# EAGLE design main (EAGLE 5.05)

## Sheet 1 of 4
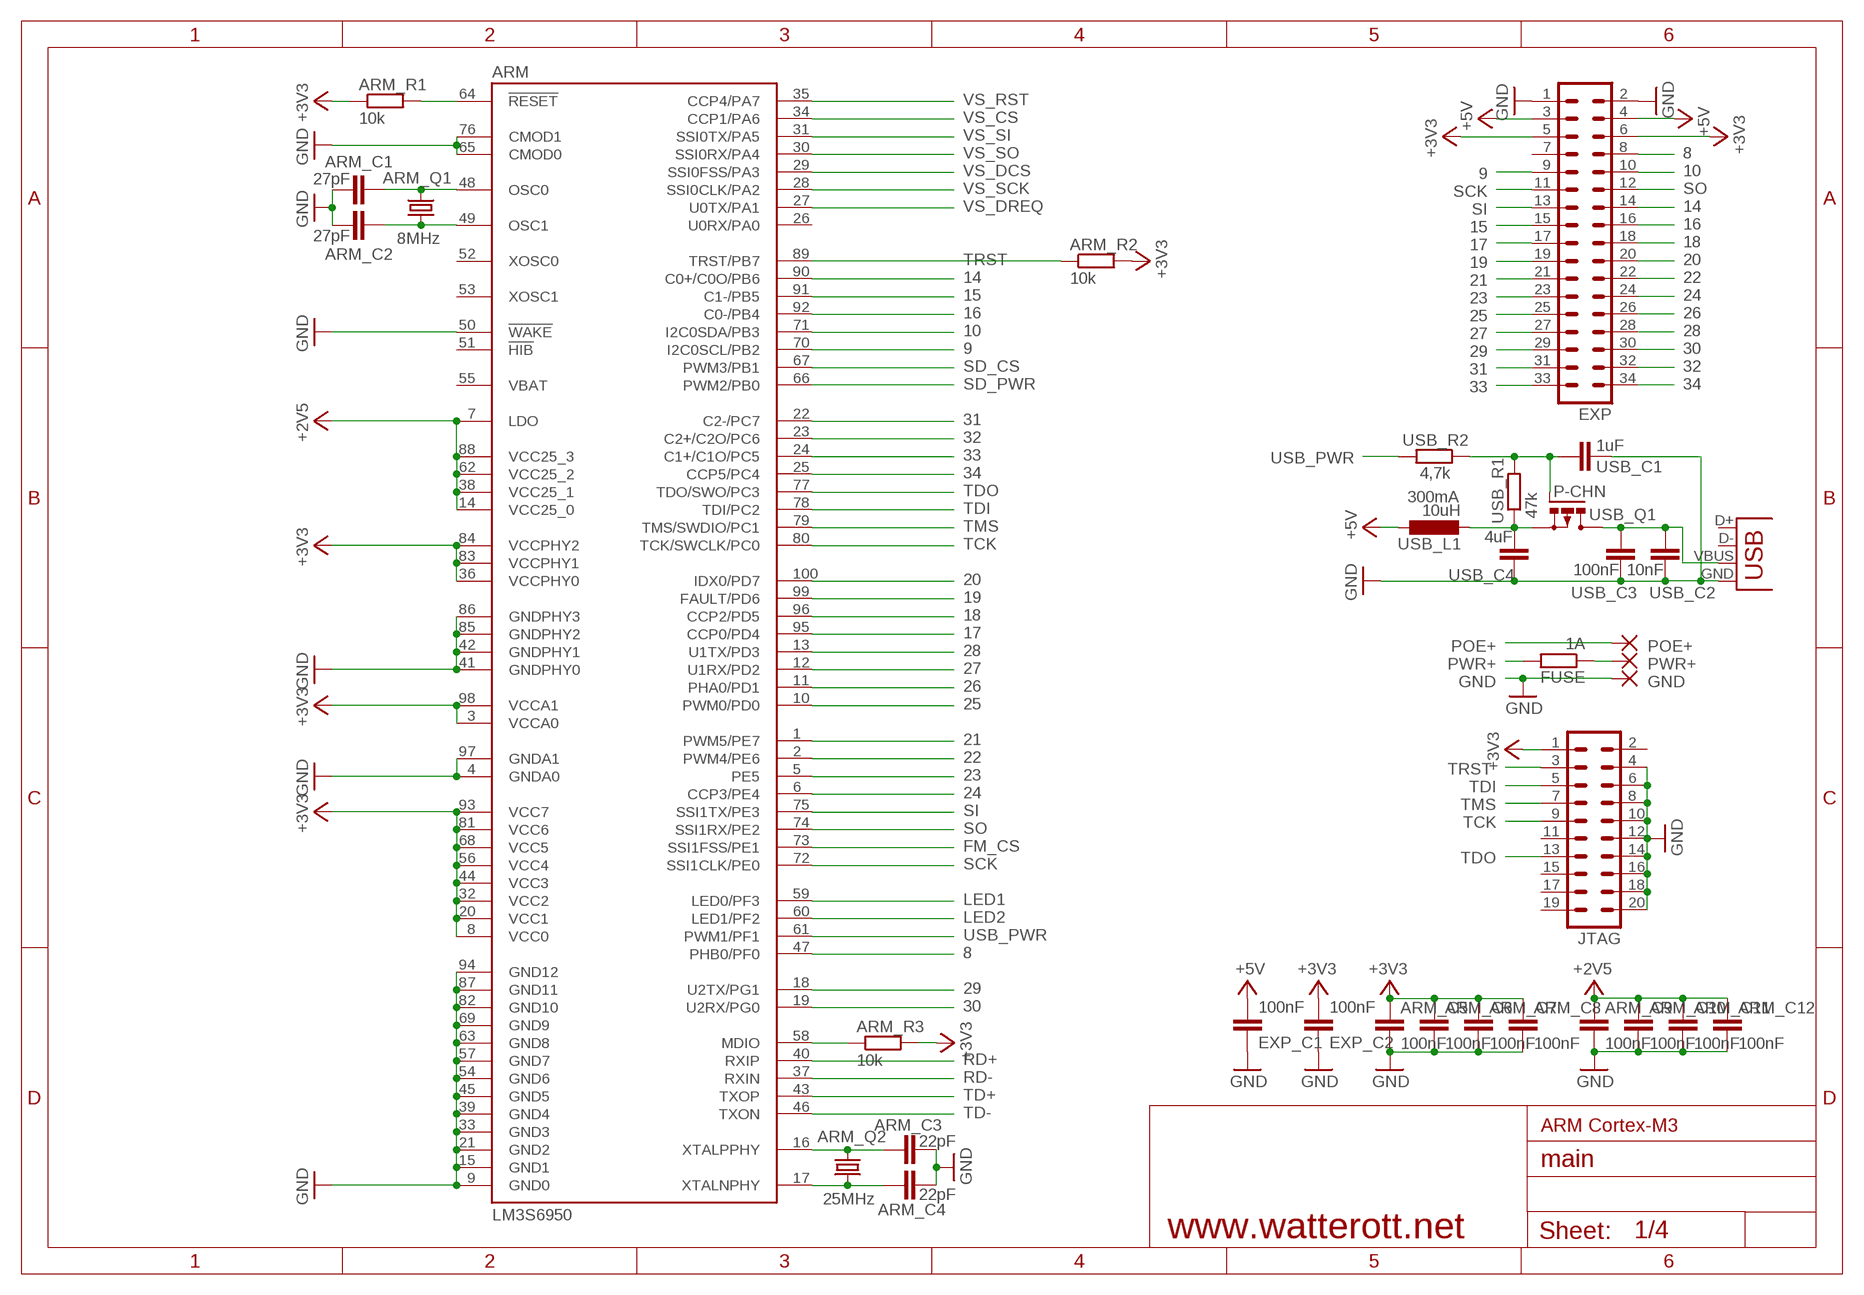
[diagram p0: schematic, sheet 1]

### Parts
ARM  LM3S6950  [LQFP100]
ARM_C1  27pF  C-EUC0603  [C0603]
ARM_C2  27pF  C-EUC0603  [C0603]
ARM_C3  22pF  C-EUC0603  [C0603]
ARM_C4  22pF  C-EUC0603  [C0603]
ARM_C5  100nF  C-EUC0603  [C0603]
ARM_C6  100nF  C-EUC0603  [C0603]
ARM_C7  100nF  C-EUC0603  [C0603]
ARM_C8  100nF  C-EUC0603  [C0603]
ARM_C9  100nF  C-EUC0603  [C0603]
ARM_C10  100nF  C-EUC0603  [C0603]
ARM_C11  100nF  C-EUC0603  [C0603]
ARM_C12  100nF  C-EUC0603  [C0603]
ARM_Q1  8MHz  HC49UP  [HC49UP]
ARM_Q2  25MHz  HC49UP  [HC49UP]
ARM_R1  10k  R-EU_R0603  [R0603]
ARM_R2  10k  R-EU_R0603  [R0603]
ARM_R3  10k  R-EU_R0603  [R0603]
EXP  MA17-2  [MA17-2]
EXP_C1  100nF  C-EUC0603  [C0603]
EXP_C2  100nF  C-EUC0603  [C0603]
FUSE  1A  R-EU_R1206  [R1206]
GND  SMD2  [SMD1,27-2,54]
JTAG  MA10-2  [MA10-2]
POE+  SMD2  [SMD1,27-2,54]
PWR+  SMD2  [SMD1,27-2,54]
USB  USB-A-S  [USB-A-S]
USB_C1  1uF  C-EUC0603  [C0603]
USB_C2  10nF  C-EUC0603  [C0603]
USB_C3  100nF  C-EUC0603  [C0603]
USB_C4  4uF  C-EUC1206  [C1206]
USB_L1  10uH  L-EUL4532C  [L4532M]
USB_Q1  P-CHN  IRLML6402  [MICRO3]
USB_R1  47k  R-EU_R0603  [R0603]
USB_R2  4,7k  R-EU_R0603  [R0603]

### Nets
8: ARM.47(PHB0/PF0) EXP.8
9: ARM.70(I2C0SCL/PB2) EXP.9
10: ARM.71(I2C0SDA/PB3) EXP.10
14: ARM.90(C0+/C0O/PB6) EXP.14
15: ARM.91(C1-/PB5) EXP.15
16: ARM.92(C0-/PB4) EXP.16
17: ARM.95(CCP0/PD4) EXP.17
18: ARM.96(CCP2/PD5) EXP.18
19: ARM.99(FAULT/PD6) EXP.19
20: ARM.100(IDX0/PD7) EXP.20
21: ARM.1(PWM5/PE7) EXP.21
22: ARM.2(PWM4/PE6) EXP.22
23: ARM.5(PE5) EXP.23
24: ARM.6(CCP3/PE4) EXP.24
25: ARM.10(PWM0/PD0) EXP.25
26: ARM.11(PHA0/PD1) EXP.26
27: ARM.12(U1RX/PD2) EXP.27
28: ARM.13(U1TX/PD3) EXP.28
29: ARM.18(U2TX/PG1) EXP.29
30: ARM.19(U2RX/PG0) EXP.30
31: ARM.22(C2-/PC7) EXP.31
32: ARM.23(C2+/C2O/PC6) EXP.32
33: ARM.24(C1+/C1O/PC5) EXP.33
34: ARM.25(CCP5/PC4) EXP.34
+3V3: ARM.3(VCCA0) ARM.8(VCC0) ARM.20(VCC1) ARM.32(VCC2) ARM.36(VCCPHY0) ARM.44(VCC3) ARM.56(VCC4) ARM.68(VCC5) ARM.81(VCC6) ARM.83(VCCPHY1) ARM.84(VCCPHY2) ARM.93(VCC7) ARM.98(VCCA1) ARM_C5.1 ARM_C6.1 ARM_C7.1 ARM_C8.1 ARM_R1.1 ARM_R2.2 ARM_R3.2 EXP.5 EXP.6 EXP_C2.2 JTAG.1 ; also sheet 2,3,4
+5V: EXP.3 EXP.4 EXP_C1.2 USB_L1.1 ; also sheet 4
FM_CS: ARM.73(SSI1FSS/PE1) ; also sheet 2
GND: ARM.4(GNDA0) ARM.9(GND0) ARM.15(GND1) ARM.21(GND2) ARM.33(GND3) ARM.39(GND4) ARM.41(GNDPHY0) ARM.42(GNDPHY1) ARM.45(GND5) ARM.50(!WAKE) ARM.54(GND6) ARM.57(GND7) ARM.63(GND8) ARM.65(CMOD0) ARM.69(GND9) ARM.76(CMOD1) ARM.82(GND10) ARM.85(GNDPHY2) ARM.86(GNDPHY3) ARM.87(GND11) ARM.94(GND12) ARM.97(GNDA1) ARM_C1.2 ARM_C2.2 ARM_C3.2 ARM_C4.2 ARM_C5.2 ARM_C6.2 ARM_C7.2 ARM_C8.2 ARM_C9.2 ARM_C10.2 ARM_C11.2 ARM_C12.2 EXP.1 EXP.2 EXP_C1.1 EXP_C2.1 GND.1(P) JTAG.4 JTAG.6 JTAG.8 JTAG.10 JTAG.12 JTAG.14 JTAG.16 JTAG.18 JTAG.20 USB.GND USB_C1.1 USB_C2.2 USB_C3.2 USB_C4.1 ; also sheet 2,3,4
LED1: ARM.59(LED0/PF3) ; also sheet 2
LED2: ARM.60(LED1/PF2) ; also sheet 2
MDIO: ARM.58(MDIO) ARM_R3.1
N$2: USB_C4.2 USB_L1.2 USB_Q1.2(S) USB_R1.1
N$9: ARM.48(OSC0) ARM_C1.1 ARM_Q1.2
N$10: ARM.49(OSC1) ARM_C2.1 ARM_Q1.1
N$12: USB.VBUS USB_C2.1 USB_C3.1 USB_Q1.3(D)
N$13: ARM.17(XTALNPHY) ARM_C4.1 ARM_Q2.2
N$14: ARM.16(XTALPPHY) ARM_C3.1 ARM_Q2.1
N$16: USB_C1.2 USB_Q1.1(G) USB_R1.2 USB_R2.1
POE+: POE+.1(P) ; also sheet 2
PWR+: FUSE.2 ; also sheet 2,4
RD+: ARM.40(RXIP) ; also sheet 2
RD-: ARM.37(RXIN) ; also sheet 2
RESET: ARM.64(!RESET) ARM_R1.2
SCK: ARM.72(SSI1CLK/PE0) EXP.11 ; also sheet 2
SD_CS: ARM.67(PWM3/PB1) ; also sheet 2
SD_PWR: ARM.66(PWM2/PB0) ; also sheet 2
SI: ARM.75(SSI1TX/PE3) EXP.13 ; also sheet 2
SO: ARM.74(SSI1RX/PE2) EXP.12 ; also sheet 2
TCK: ARM.80(TCK/SWCLK/PC0) JTAG.9
TD+: ARM.43(TXOP) ; also sheet 2
TD-: ARM.46(TXON) ; also sheet 2
TDI: ARM.78(TDI/PC2) JTAG.5
TDO: ARM.77(TDO/SWO/PC3) JTAG.13
TMS: ARM.79(TMS/SWDIO/PC1) JTAG.7
TRST: ARM.89(TRST/PB7) ARM_R2.1 JTAG.3
USB_PWR: ARM.61(PWM1/PF1) USB_R2.2
VCC: FUSE.1 PWR+.1(P)
VCCIO: ARM.7(LDO) ARM.14(VCC25_0) ARM.38(VCC25_1) ARM.62(VCC25_2) ARM.88(VCC25_3) ARM_C9.1 ARM_C10.1 ARM_C11.1 ARM_C12.1 ; supply symbol labelled +2V5
VS_CS: ARM.34(CCP1/PA6) ; also sheet 3
VS_DCS: ARM.29(SSI0FSS/PA3) ; also sheet 3
VS_DREQ: ARM.27(U0TX/PA1) ; also sheet 3
VS_RST: ARM.35(CCP4/PA7) ; also sheet 3
VS_SCK: ARM.28(SSI0CLK/PA2) ; also sheet 3
VS_SI: ARM.31(SSI0TX/PA5) ; also sheet 3
VS_SO: ARM.30(SSI0RX/PA4) ; also sheet 3
Unconnected: ARM.26(U0RX/PA0) ARM.51(!HIB) ARM.52(XOSC0) ARM.53(XOSC1) EXP.7 JTAG.2 JTAG.11 JTAG.15 JTAG.17 JTAG.19 USB.D+ USB.D-

### Notes on the sheet
- 300mA
- ARM Cortex-M3
- www.watterott.net

## Sheet 2 of 4
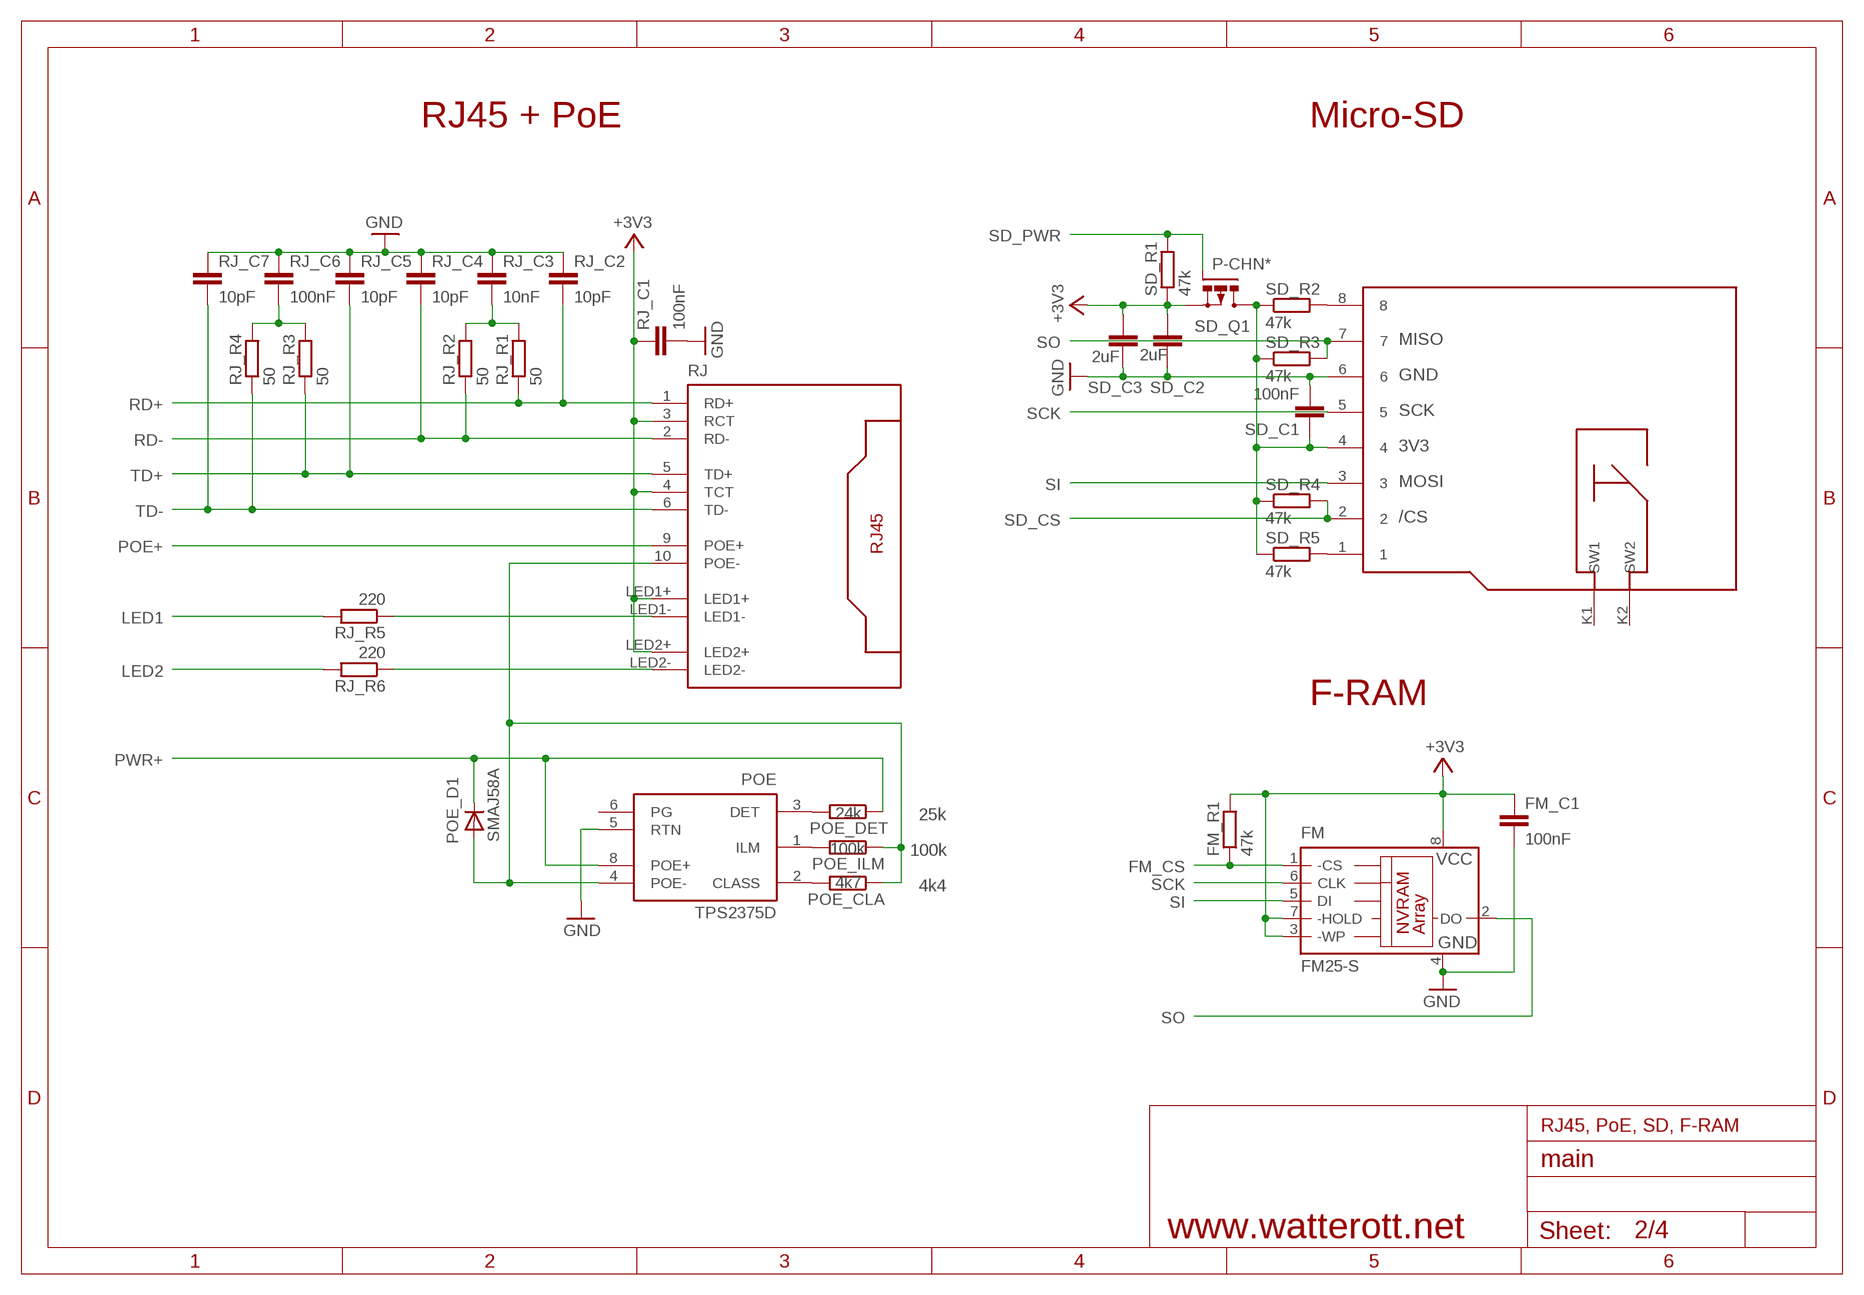
[diagram p1: schematic, sheet 2]

### Parts
FM  FM25-S  [SO8]
FM_C1  100nF  C-EUC0603  [C0603]
FM_R1  47k  R-EU_R0603  [R0603]
POE  TPS2375D  TPS237X  [SO08]
POE_CLA  4k7  R-EU_R0603  [R0603]
POE_D1  SMAJ58A  DIODE-DO214AA  [DO214AA]
POE_DET  24k  R-EU_R0603  [R0603]
POE_ILM  100k  R-EU_R0603  [R0603]
RJ  RJ45-8-POEWE  [WE_POE]
RJ_C1  100nF  C-EUC0603  [C0603]
RJ_C2  10pF  C-EUC0603  [C0603]
RJ_C3  10nF  C-EUC0603  [C0603]
RJ_C4  10pF  C-EUC0603  [C0603]
RJ_C5  10pF  C-EUC0603  [C0603]
RJ_C6  100nF  C-EUC0603  [C0603]
RJ_C7  10pF  C-EUC0603  [C0603]
RJ_R1  50  R-EU_R0603  [R0603]
RJ_R2  50  R-EU_R0603  [R0603]
RJ_R3  50  R-EU_R0603  [R0603]
RJ_R4  50  R-EU_R0603  [R0603]
RJ_R5  220  R-EU_R0603  [R0603]
RJ_R6  220  R-EU_R0603  [R0603]
SD  MICRO-SD  [MICRO-SD]
SD_C1  100nF  C-EUC0603  [C0603]
SD_C2  2uF  C-EUC0603  [C0603]
SD_C3  2uF  C-EUC0805  [C0805]
SD_Q1  P-CHN*  IRLML6402  [MICRO3]
SD_R1  47k  R-EU_R0603  [R0603]
SD_R2  47k  R-EU_R0603  [R0603]
SD_R3  47k  R-EU_R0603  [R0603]
SD_R4  47k  R-EU_R0603  [R0603]
SD_R5  47k  R-EU_R0603  [R0603]

### Nets
+3V3: FM.3(-WP) FM.7(-HOLD) FM.8(VCC) FM_C1.1 FM_R1.2 RJ.3(RCT) RJ.4(TCT) RJ.LED1+ RJ.LED2+ RJ_C1.1 SD_C2.2 SD_C3.2 SD_Q1.2(S) SD_R1.1 ; also sheet 1,3,4
CLASS: POE.2(CLASS) POE_CLA.2
DET: POE.3(DET) POE_DET.2
FM_CS: FM.1(-CS) FM_R1.1 ; also sheet 1
GND: FM.4(GND) FM_C1.2 POE.5(RTN) RJ_C1.2 RJ_C2.1 RJ_C3.1 RJ_C4.1 RJ_C5.1 RJ_C6.1 RJ_C7.1 SD.6 SD_C1.2 SD_C2.1 SD_C3.1 ; also sheet 1,3,4
ILM: POE.1(ILM) POE_ILM.2
LED1: RJ_R5.2 ; also sheet 1
LED2: RJ_R6.2 ; also sheet 1
N$3: SD.1 SD_R5.2
N$4: RJ.LED2- RJ_R6.1
N$5: RJ.LED1- RJ_R5.1
N$6: RJ_C6.2 RJ_R3.2 RJ_R4.2
N$7: RJ_C3.2 RJ_R1.2 RJ_R2.2
N$15: SD.8 SD_R2.2
POE+: RJ.9(POE+) ; also sheet 1
POE-: POE.4(POE-) POE_CLA.1 POE_D1.A POE_ILM.1 RJ.10(POE-)
PWR+: POE.8(POE+) POE_D1.C POE_DET.1 ; also sheet 1,4
RD+: RJ.1(RD+) RJ_C2.2 RJ_R1.1 ; also sheet 1
RD-: RJ.2(RD-) RJ_C4.2 RJ_R2.1 ; also sheet 1
SCK: FM.6(CLK) SD.5 ; also sheet 1
SD_3V3: SD.4 SD_C1.1 SD_Q1.3(D) SD_R2.1 SD_R3.1 SD_R4.1 SD_R5.1
SD_CS: SD.2 SD_R4.2 ; also sheet 1
SD_PWR: SD_Q1.1(G) SD_R1.2 ; also sheet 1
SI: FM.5(DI) SD.3 ; also sheet 1
SO: FM.2(DO) SD.7 SD_R3.2 ; also sheet 1
TD+: RJ.5(TD+) RJ_C5.2 RJ_R3.1 ; also sheet 1
TD-: RJ.6(TD-) RJ_C7.2 RJ_R4.1 ; also sheet 1
Unconnected: POE.6(PG) SD.K1(SW1) SD.K2(SW2)

### Notes on the sheet
- RJ45 + PoE | Micro-SD
- F-RAM
- 25k
- 100k
- 4k4
- RJ45, PoE, SD, F-RAM
- www.watterott.net

## Sheet 3 of 4
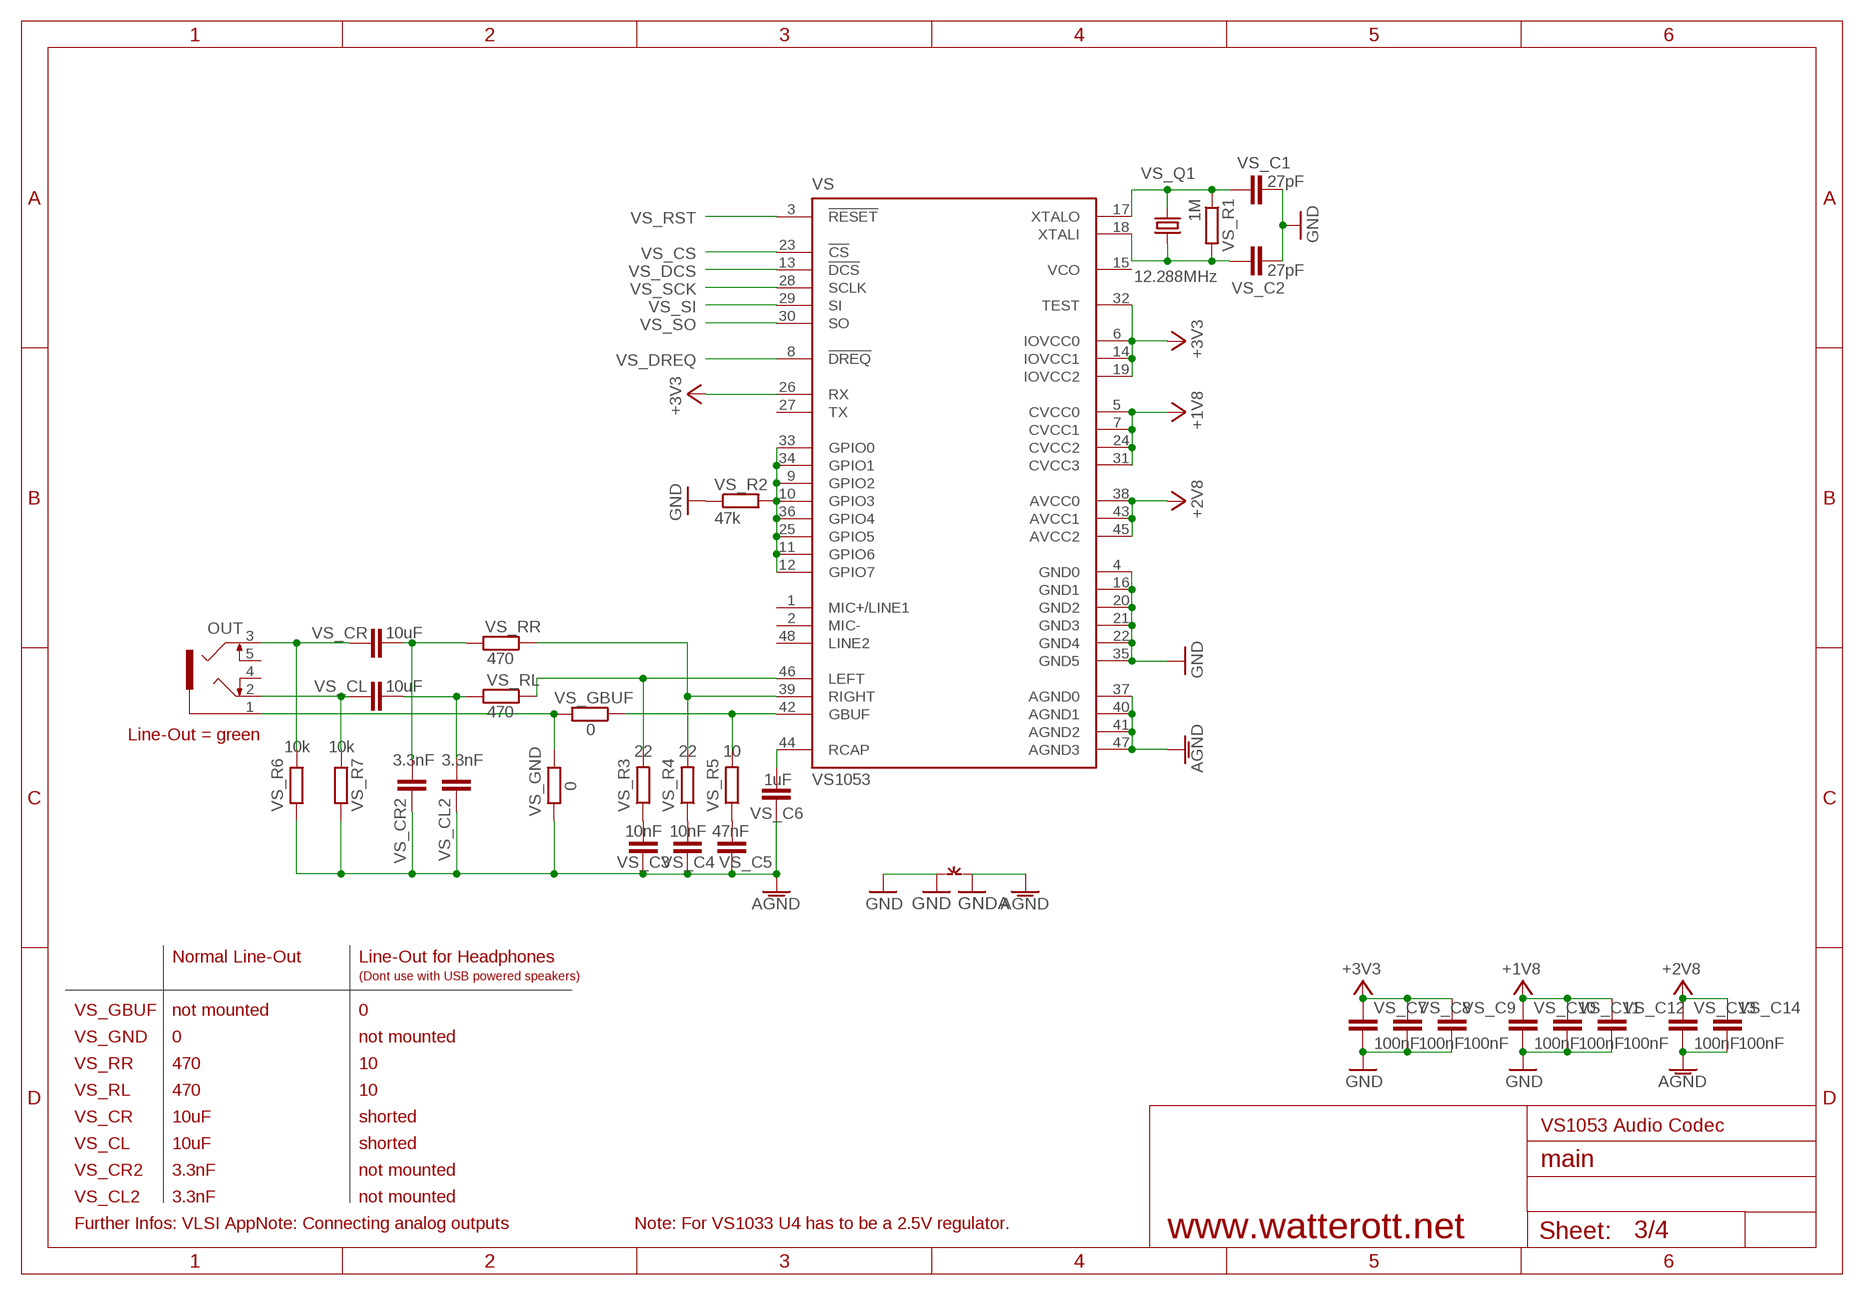
[diagram p2: schematic, sheet 3]

### Parts
OUT  1503_09  [1503_09]
VS  VS1053  [LQFP-48]
VS_C1  27pF  C-EUC0603  [C0603]
VS_C2  27pF  C-EUC0603  [C0603]
VS_C3  10nF  C-EUC0603  [C0603]
VS_C4  10nF  C-EUC0603  [C0603]
VS_C5  47nF  C-EUC0603  [C0603]
VS_C6  1uF  C-EUC0603  [C0603]
VS_C7  100nF  C-EUC0603  [C0603]
VS_C8  100nF  C-EUC0603  [C0603]
VS_C9  100nF  C-EUC0603  [C0603]
VS_C10  100nF  C-EUC0603  [C0603]
VS_C11  100nF  C-EUC0603  [C0603]
VS_C12  100nF  C-EUC0603  [C0603]
VS_C13  100nF  C-EUC0603  [C0603]
VS_C14  100nF  C-EUC0603  [C0603]
VS_CL  10uF  C-EUC1812  [C1812]
VS_CL2  3.3nF  C-EUC0603  [C0603]
VS_CR  10uF  C-EUC1812  [C1812]
VS_CR2  3.3nF  C-EUC0603  [C0603]
VS_GBUF  0  R-EU_R0603  [R0603]
VS_GND  0  R-EU_R0603  [R0603]
VS_Q1  12.288MHz  HC49UP  [HC49UP]
VS_R1  1M  R-EU_R0603  [R0603]
VS_R2  47k  R-EU_R0603  [R0603]
VS_R3  22  R-EU_R0603  [R0603]
VS_R4  22  R-EU_R0603  [R0603]
VS_R5  10  R-EU_R0603  [R0603]
VS_R6  10k  R-EU_R0603  [R0603]
VS_R7  10k  R-EU_R0603  [R0603]
VS_RL  470  R-EU_R0603  [R0603]
VS_RR  470  R-EU_R0603  [R0603]
~NUDEV~1  GND-GNDA  [GND-GNDA]

### Nets
+1V8: VS.5(CVCC0) VS.7(CVCC1) VS.24(CVCC2) VS.31(CVCC3) VS_C10.1 VS_C11.1 VS_C12.1 ; also sheet 4
+2V8: VS.38(AVCC0) VS.43(AVCC1) VS.45(AVCC2) VS_C13.1 VS_C14.1 ; also sheet 4
+3V3: VS.6(IOVCC0) VS.14(IOVCC1) VS.19(IOVCC2) VS.26(RX) VS.32(TEST) VS_C7.1 VS_C8.1 VS_C9.1 ; also sheet 1,2,4
AGND: VS.37(AGND0) VS.40(AGND1) VS.41(AGND2) VS.47(AGND3) VS_C3.1 VS_C4.1 VS_C5.1 VS_C6.1 VS_C13.2 VS_C14.2 VS_CL2.2 VS_CR2.2 VS_GND.2 VS_R6.2 VS_R7.2 ~NUDEV~1.GNDA ; also sheet 4
GBUF: VS.42(GBUF) VS_GBUF.1 VS_R5.2
GND: VS.4(GND0) VS.16(GND1) VS.20(GND2) VS.21(GND3) VS.22(GND4) VS.35(GND5) VS_C1.2 VS_C2.2 VS_C7.2 VS_C8.2 VS_C9.2 VS_C10.2 VS_C11.2 VS_C12.2 VS_R2.1 ~NUDEV~1.GND ; also sheet 1,2,4
GPIO: VS.9(GPIO2) VS.10(GPIO3) VS.11(GPIO6) VS.12(GPIO7) VS.25(GPIO5) VS.33(GPIO0) VS.34(GPIO1) VS.36(GPIO4) VS_R2.2
LEFT: VS.46(LEFT) VS_R3.2 VS_RL.1
N$8: VS.18(XTALI) VS_C2.1 VS_Q1.1 VS_R1.2
N$11: VS.17(XTALO) VS_C1.1 VS_Q1.2 VS_R1.1
N$18: OUT.1 VS_GBUF.2 VS_GND.1
N$19: OUT.3 VS_CR.2 VS_R6.1
N$20: OUT.2 VS_CL.2 VS_R7.1
N$21: VS_CR2.1 VS_CR.1 VS_RR.2
N$22: VS_CL2.1 VS_CL.1 VS_RL.2
N$31: VS_C3.2 VS_R3.1
N$32: VS_C4.2 VS_R4.1
N$33: VS_C5.2 VS_R5.1
RCAP: VS.44(RCAP) VS_C6.2
RIGHT: VS.39(RIGHT) VS_R4.2 VS_RR.1
VS_CS: VS.23(!CS) ; also sheet 1
VS_DCS: VS.13(!DCS) ; also sheet 1
VS_DREQ: VS.8(!DREQ) ; also sheet 1
VS_RST: VS.3(!RESET) ; also sheet 1
VS_SCK: VS.28(SCLK) ; also sheet 1
VS_SI: VS.29(SI) ; also sheet 1
VS_SO: VS.30(SO) ; also sheet 1
Unconnected: OUT.4 OUT.5 VS.1(MIC+/LINE1) VS.2(MIC-) VS.15(VCO) VS.27(TX) VS.48(LINE2)

### Notes on the sheet
- Line-Out = green
- Normal Line-Out | Line-Out for Headphones
- (Dont use with USB powered speakers)
- VS_GBUF | not mounted | 0
- VS_GND | 0 | not mounted
- VS_RR | 470 | 10
- VS_RL | 470 | 10
- VS_CR | 10uF | shorted
- VS1053 Audio Codec
- VS_CL | 10uF | shorted
- VS_CR2 | 3.3nF | not mounted
- VS_CL2 | 3.3nF | not mounted
- Further Infos: VLSI AppNote: Connecting analog outputs | Note: For VS1033 U4 has to be a 2.5V regulator.
- www.watterott.net

## Sheet 4 of 4
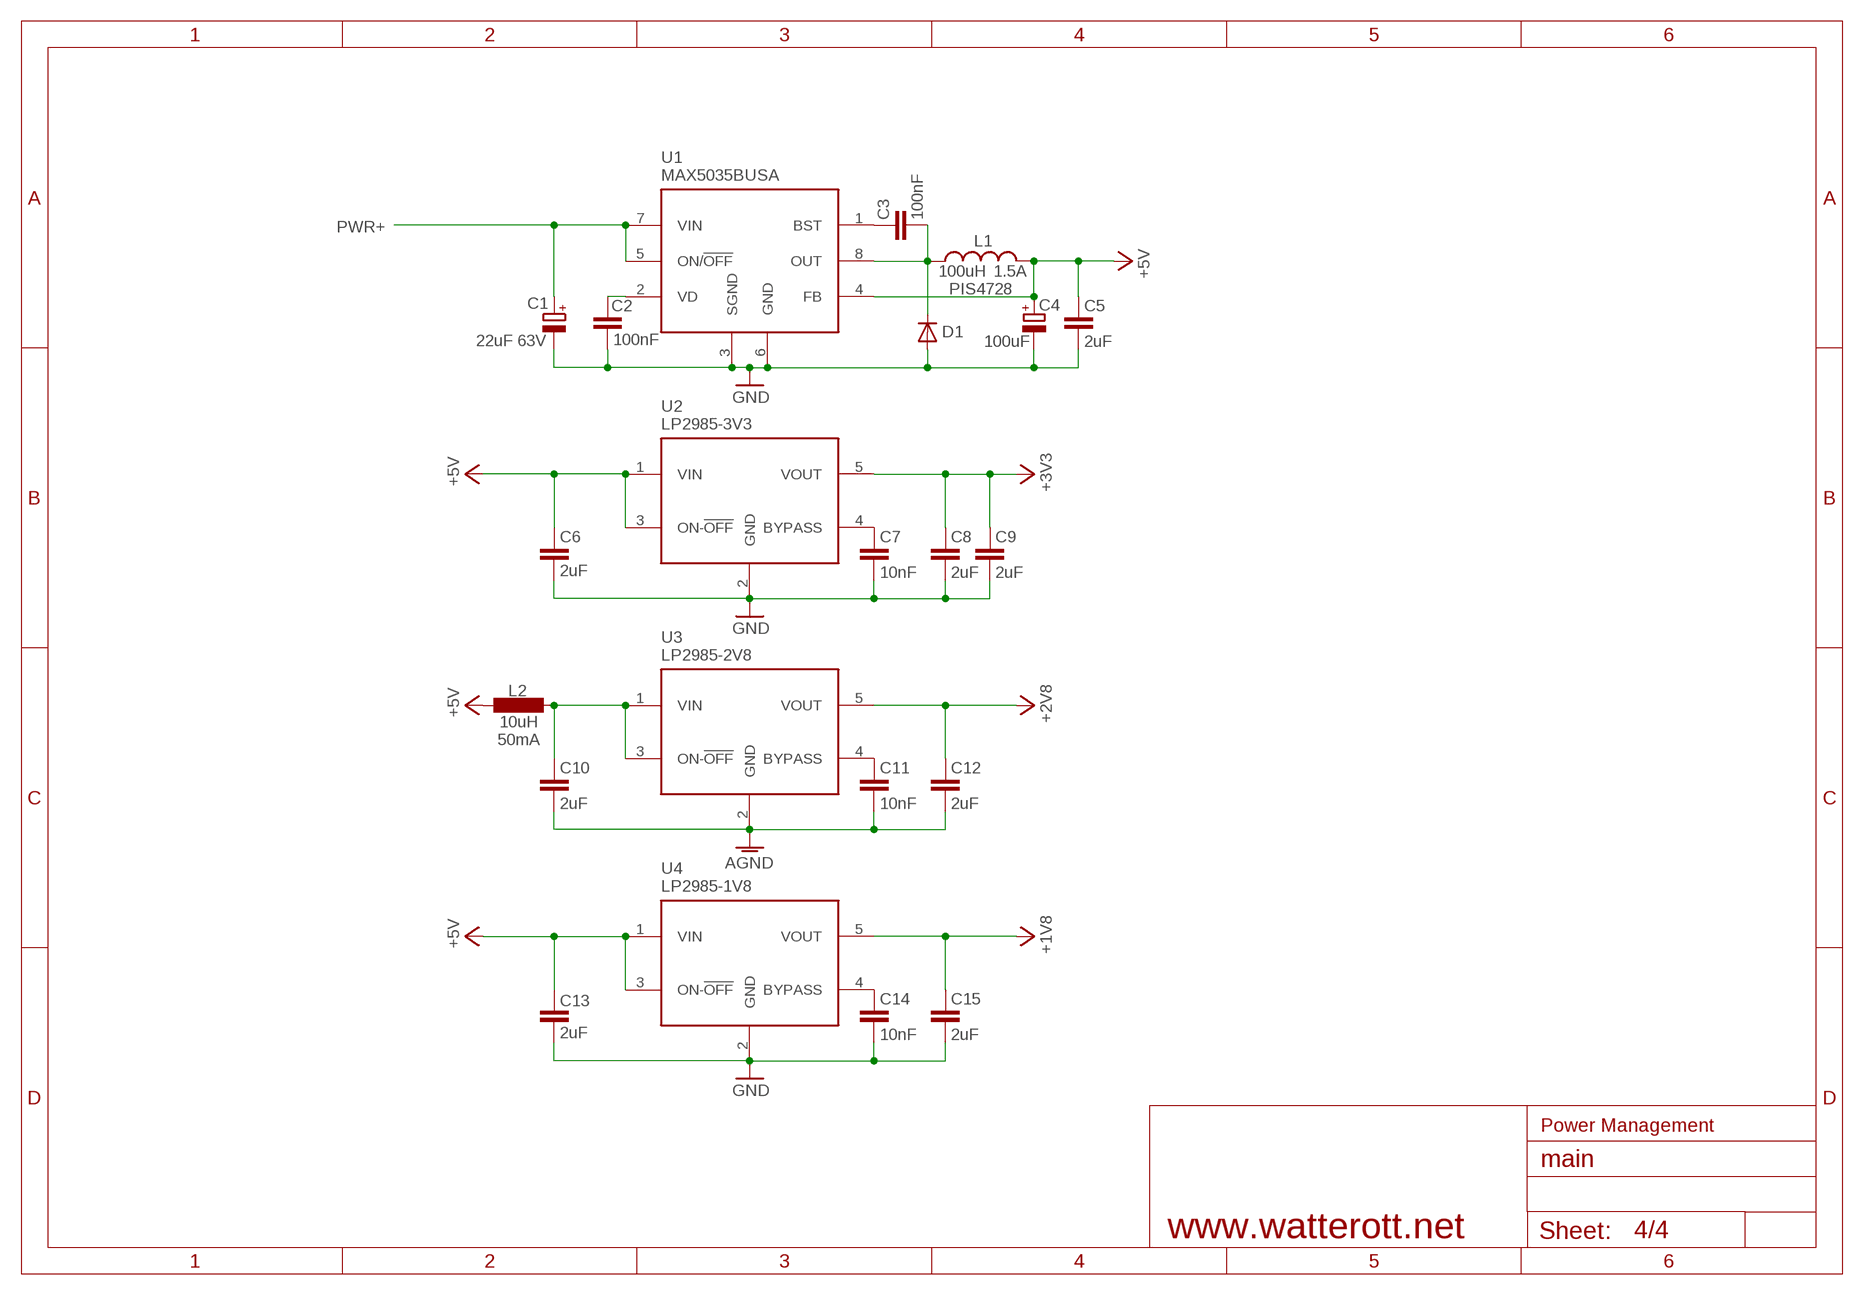
[diagram p3: schematic, sheet 4]

### Parts
C1  22uF 63V  CPOL-EU153CLV-0810  [153CLV-0810]
C2  100nF  C-EUC0603  [C0603]
C3  100nF  C-EUC0603  [C0603]
C4  100uF  CPOL-EU153CLV-0810  [153CLV-0810]
C5  2uF  C-EUC0603  [C0603]
C6  2uF  C-EUC0603  [C0603]
C7  10nF  C-EUC0603  [C0603]
C8  2uF  C-EUC0603  [C0603]
C9  2uF  C-EUC0603  [C0603]
C10  2uF  C-EUC0603  [C0603]
C11  10nF  C-EUC0603  [C0603]
C12  2uF  C-EUC0603  [C0603]
C13  2uF  C-EUC0603  [C0603]
C14  10nF  C-EUC0603  [C0603]
C15  2uF  C-EUC0603  [C0603]
D1  Schottky 90V  DIODE-DO214AA  [DO214AA]
L1  100uH  INDUCTORCDRH  [CDRH]
L2  10uH  L-EUL3216C  [L3216C]
U1  MAX5035BUSA  MAX5035  [SO8]
U2  LP2985-3V3  LP2985  [SOT23-5]
U3  LP2985-2V8  LP2985  [SOT23-5]
U4  LP2985-1V8  LP2985  [SOT23-5]

### Nets
+1V8: C15.1 U4.5(VOUT) ; also sheet 3
+2V8: C12.1 U3.5(VOUT) ; also sheet 3
+3V3: C8.1 C9.1 U2.5(VOUT) ; also sheet 1,2,3
+5V: C4.+ C5.1 C6.2 C13.2 L1.2 L2.1 U1.4(FB) U2.1(VIN) U2.3(ON-!OFF) U4.1(VIN) U4.3(ON-!OFF) ; also sheet 1
AGND: C10.1 C11.2 C12.2 U3.2(GND) ; also sheet 3
BST: C3.1 U1.1(BST)
GND: C1.- C2.2 C4.- C5.2 C6.1 C7.2 C8.2 C9.2 C13.1 C14.2 C15.2 D1.A U1.3(SGND) U1.6(GND) U2.2(GND) U4.2(GND) ; also sheet 1,2,3
N$1: C10.2 L2.2 U3.1(VIN) U3.3(ON-!OFF)
N$25: C7.1 U2.4(BYPASS)
N$27: C11.1 U3.4(BYPASS)
N$28: C14.1 U4.4(BYPASS)
OUT: C3.2 D1.C L1.1 U1.8(OUT)
PWR+: C1.+ U1.5(ON/!OFF) U1.7(VIN) ; also sheet 1,2
VD: C2.1 U1.2(VD)

### Notes on the sheet
- 1.5A
- PIS4728
- 50mA
- Power Management
- www.watterott.net

## Power pins joined to a net without a drawn wire
VBAT: ARM.55(VBAT)

## Library data of the parts
ARM = Luminary:LM3S6950
ARM_C1-ARM_C12 C2 C3 C5-C15 EXP_C1 EXP_C2 FM_C1 RJ_C1-RJ_C7 SD_C1-SD_C3 USB_C1-USB_C4 VS_C1-VS_C14 VS_CL VS_CL2 VS_CR VS_CR2 = rcl:C-EU: CAPACITOR, European symbol
ARM_Q1 ARM_Q2 VS_Q1 = Crystal:HC49UP
ARM_R1-ARM_R3 FM_R1 FUSE POE_CLA POE_DET POE_ILM RJ_R1-RJ_R6 SD_R1-SD_R5 USB_R1 USB_R2 VS_GBUF VS_GND VS_R1-VS_R7 VS_RL VS_RR = rcl:R-EU_: RESISTOR, European symbol
C1 C4 = rcl:CPOL-EU: POLARIZED CAPACITOR, European symbol
D1 POE_D1 = diode:DIODE-: DIODE
EXP = con-lstb:MA17-2: PIN HEADER
FM = Ramtron:FM25*: SPI Serial NVRAM
GND POE+ PWR+ = wirepad:SMD2: SMD PAD
JTAG = con-lstb:MA10-2: PIN HEADER
L1 = Voltage-Reg:INDUCTOR
L2 USB_L1 = rcl:L-EU: INDUCTOR, European symbol
OUT = con-lumberg:1503_09: Jack connectors according to JISC 6560, 3.5 mm Klinkeneinbaukupplung nach JISC 6560, 3,5 mm, 3-polig/ stereo, abgewinkelte Ausführung, mit 2 Öffnern und Lötaugen, für Leiterplatten Rückseitenmontage Source: http://www.lumberg.com/Produkte/PDFs/1503_09.pdf
POE = ethernet:TPS237X
RJ = ethernet:RJ45-8-POE: Würth Elektronik RJ45: WE-7499211121 Tyco RJ45: 6605822
SD = SD-Card:MICRO-SD
SD_Q1 USB_Q1 = IRF-sot23:IRLML6402: P-Channel Power MOSFET
U1 = Voltage-Reg:MAX5035
U2-U4 = Voltage-Reg:LP2985
USB = con-usb:USB: USB Connectors
VS = VLSI:VS1053
~NUDEV~1 = supply-dummy:GND-GNDA: Example of GND--GNDA NET-Connetor for more info read description in package

## Board
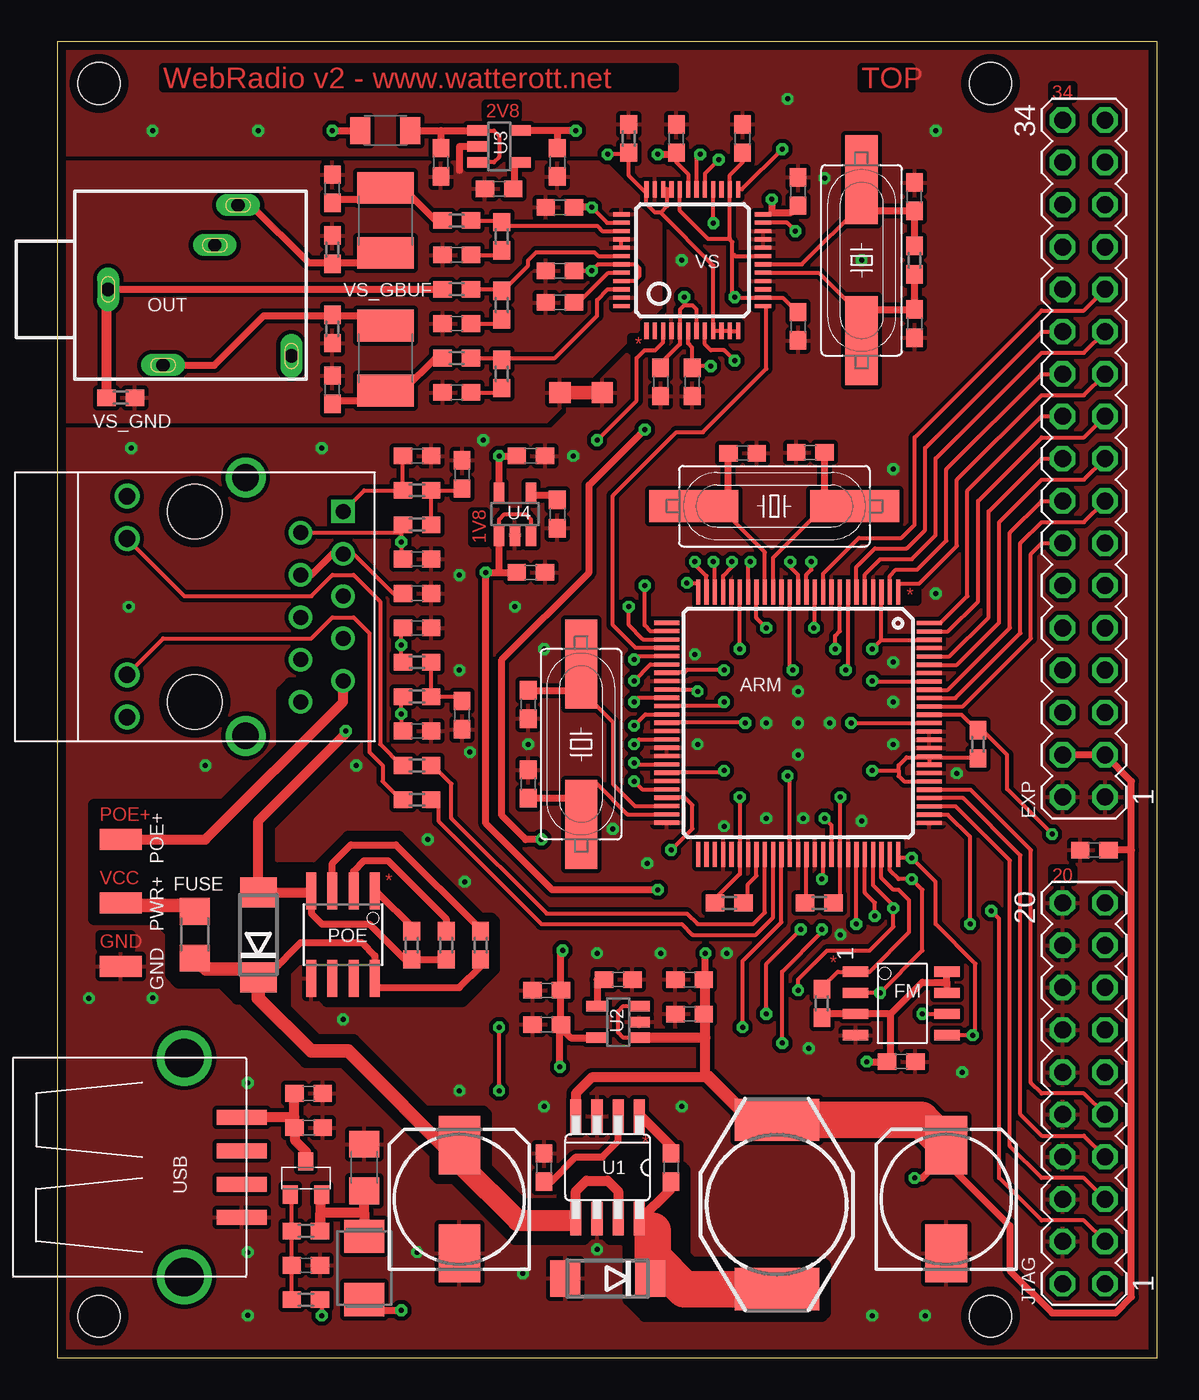
[diagram p4: board, top side]
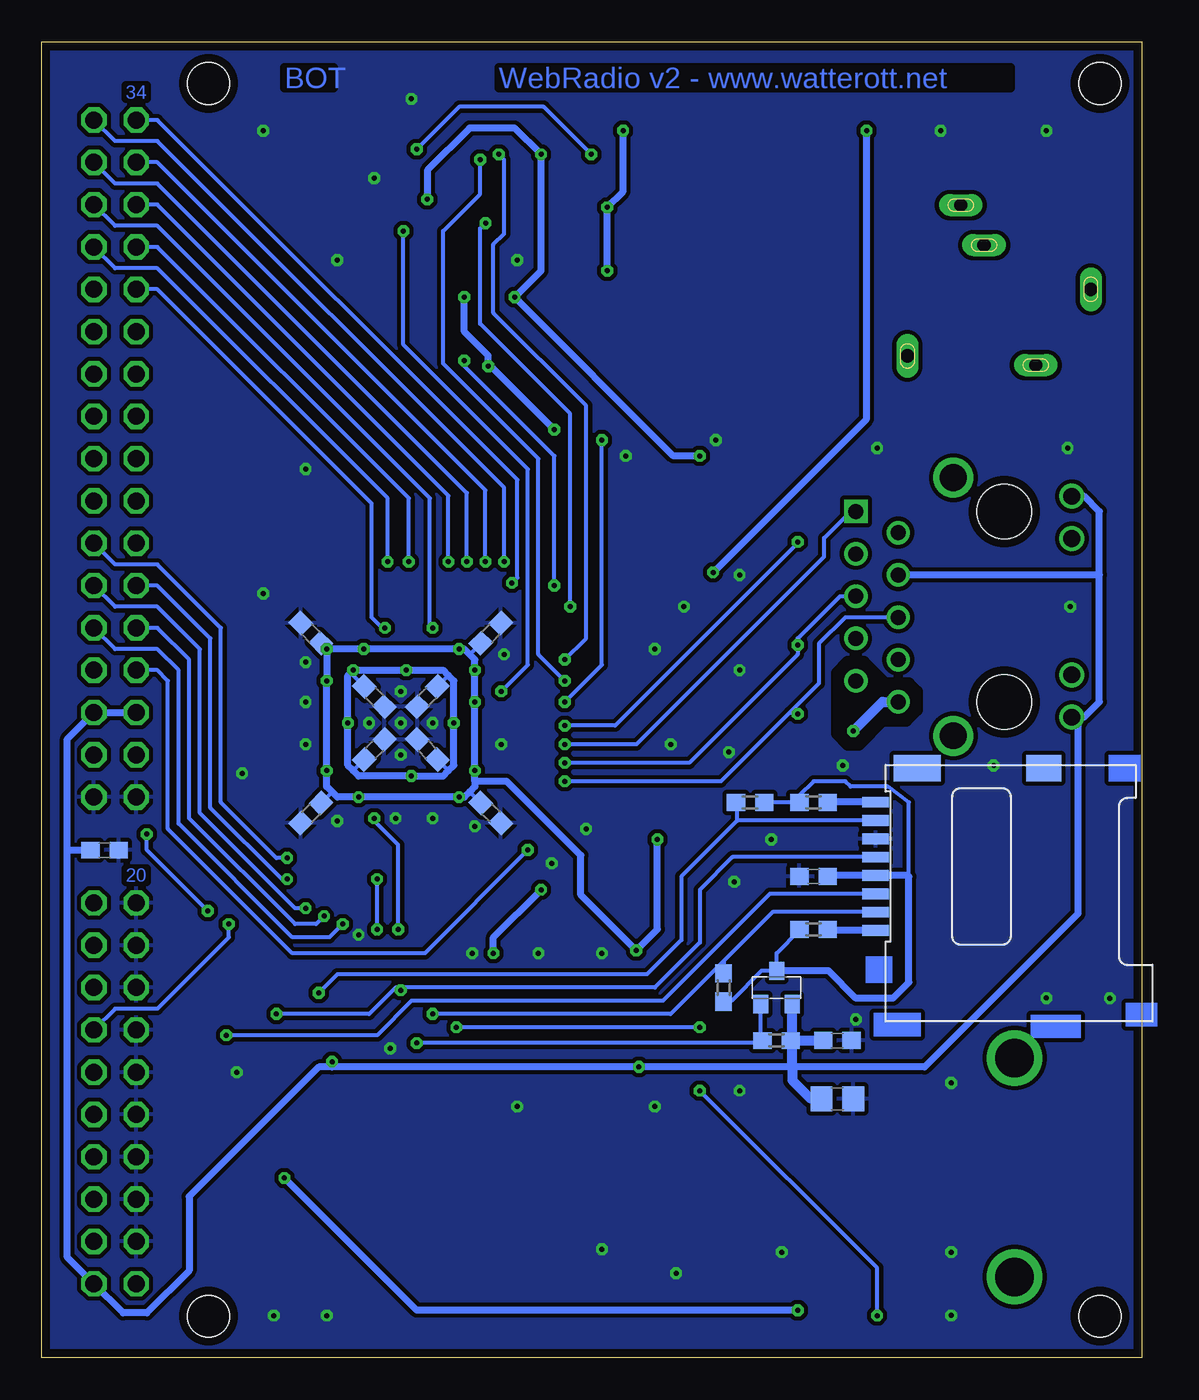
[diagram p5: board, bottom side, seen from below]

Size 66 x 79 mm. Coordinates in mm from the lower left corner, seen from the top.
Outline: 0,0 66,0 66,79 0,79 0,0
Copper layers (1*16): Top 0.035mm / dielectric 1.5mm / Bottom 0.035mm
Design rules "default *": minimum track width 7mil, minimum drill 0.3mm, track to track 7mil, track to pad 7mil, pad to pad 7mil, via to via 7mil, smd to smd 7mil, copper to edge 20mil, drill to drill 8mil, minimum pad ring 10mil, minimum via ring 8mil, stop-mask expansion 4mil, vias tented up to drill 0.5mm, thermal gap 10mil
Holes 2.5 mm at 2.5,76.5 56,76.5 2.5,2.5 56,2.5
tRestrict: area 2.2,2.5 to 46,41.8
bRestrict: area 13.5,36.8 to 18.3,41.8

### Footprints (pad centres in the part's own frame; a part is rotated, then mirrored left to right if it is on the bottom)
LQFP100 = smd 1.5 x 0.25: 1 -7.875,6; 2 -7.875,5.5; 3 -7.875,5; 4 -7.875,4.5; 5 -7.875,4; 6 -7.875,3.5; 7 -7.875,3; 8 -7.875,2.5; 9 -7.875,2; 10 -7.875,1.5; 11 -7.875,1; 12 -7.875,0.5; 13 -7.875,0; 14 -7.875,-0.5; 15 -7.875,-1; 16 -7.875,-1.5; 17 -7.875,-2; 18 -7.875,-2.5; 19 -7.875,-3; 20 -7.875,-3.5; 21 -7.875,-4; 22 -7.875,-4.5; 23 -7.875,-5; 24 -7.875,-5.5; 25 -7.875,-6; 51 7.875,-6; 52 7.875,-5.5; 53 7.875,-5; 54 7.875,-4.5; 55 7.875,-4; 56 7.875,-3.5; 57 7.875,-3; 58 7.875,-2.5; 59 7.875,-2; 60 7.875,-1.5; 61 7.875,-1; 62 7.875,-0.5; 63 7.875,0; 64 7.875,0.5; 65 7.875,1; 66 7.875,1.5; 67 7.875,2; 68 7.875,2.5; 69 7.875,3; 70 7.875,3.5; 71 7.875,4; 72 7.875,4.5; 73 7.875,5; 74 7.875,5.5; 75 7.875,6 | smd 0.25 x 1.5: 26 -6.025,-7.875; 27 -5.525,-7.875; 28 -5.025,-7.875; 29 -4.525,-7.875; 30 -4.025,-7.875; 31 -3.525,-7.875; 32 -3.025,-7.875; 33 -2.525,-7.875; 34 -2.025,-7.875; 35 -1.525,-7.875; 36 -1.025,-7.875; 37 -0.525,-7.875; 38 -0.025,-7.875; 39 0.475,-7.875; 40 0.975,-7.875; 41 1.475,-7.875; 42 1.975,-7.875; 43 2.475,-7.875; 44 2.975,-7.875; 45 3.475,-7.875; 46 3.975,-7.875; 47 4.475,-7.875; 48 4.975,-7.875; 49 5.475,-7.875; 50 5.975,-7.875; 76 6,7.875; 77 5.5,7.875; 78 5,7.875; 79 4.5,7.875; 80 4,7.875; 81 3.5,7.875; 82 3,7.875; 83 2.5,7.875; 84 2,7.875; 85 1.5,7.875; 86 1,7.875; 87 0.5,7.875; 88 0,7.875; 89 -0.5,7.875; 90 -1,7.875; 91 -1.5,7.875; 92 -2,7.875; 93 -2.5,7.875; 94 -3,7.875; 95 -3.5,7.875; 96 -4,7.875; 97 -4.5,7.875; 98 -5,7.875; 99 -5.5,7.875; 100 -6,7.875
C0603 = smd 1.1 x 1: 1 -0.85,0; 2 0.85,0
HC49UP = smd 5.334 x 1.93: 1 -4.826,0; 2 4.826,0
R0603 = smd 1.1 x 1: 1 -0.85,0; 2 0.85,0
153CLV-0810 = smd 3.5 x 2.5: + 3.25,0; - -3.25,0
DO214AA = smd 1.8 x 2.2: A 2.55,0; C -2.55,0
MA17-2 = drill 1.016 octagon: 1 -20.32,-1.27; 2 -20.32,1.27; 3 -17.78,-1.27; 4 -17.78,1.27; 5 -15.24,-1.27; 6 -15.24,1.27; 7 -12.7,-1.27; 8 -12.7,1.27; 9 -10.16,-1.27; 10 -10.16,1.27; 11 -7.62,-1.27; 12 -7.62,1.27; 13 -5.08,-1.27; 14 -5.08,1.27; 15 -2.54,-1.27; 16 -2.54,1.27; 17 0,-1.27; 18 0,1.27; 19 2.54,-1.27; 20 2.54,1.27; 21 5.08,-1.27; 22 5.08,1.27; 23 7.62,-1.27; 24 7.62,1.27; 25 10.16,-1.27; 26 10.16,1.27; 27 12.7,-1.27; 28 12.7,1.27; 29 15.24,-1.27; 30 15.24,1.27; 31 17.78,-1.27; 32 17.78,1.27; 33 20.32,-1.27; 34 20.32,1.27
SO8 = smd 0.61 x 1.524: 1 -1.27,-2.743; 2 0,-2.743; 3 1.27,-2.743; 4 2.54,-2.743; 5 2.54,2.743; 6 1.27,2.743; 7 0,2.743; 8 -1.27,2.743
R1206 = smd 1.6 x 1.8: 1 -1.4,0; 2 1.4,0
SMD1,27-2,54 = smd 1.27 x 2.54: 1 0,0
MA10-2 = drill 1.016 octagon: 1 -11.43,-1.27; 2 -11.43,1.27; 3 -8.89,-1.27; 4 -8.89,1.27; 5 -6.35,-1.27; 6 -6.35,1.27; 7 -3.81,-1.27; 8 -3.81,1.27; 9 -1.27,-1.27; 10 -1.27,1.27; 11 1.27,-1.27; 12 1.27,1.27; 13 3.81,-1.27; 14 3.81,1.27; 15 6.35,-1.27; 16 6.35,1.27; 17 8.89,-1.27; 18 8.89,1.27; 19 11.43,-1.27; 20 11.43,1.27
CDRH = smd 2.54 x 5.08: 1 -5.08,0; 2 5.08,0
L3216C = smd 1.2 x 1.6: 1 -1.5,0; 2 1.5,0
1503_09 = drill 0.8 pad 1.2 long: 1 0,-2.1; 2 -4.55,-5.4; 3 5.05,-9.9; 4 -4,-13.1; 5 2.65,-8.5
SO08 = smd 0.61 x 2.21: 1 -1.905,-2.616; 2 -0.635,-2.616; 3 0.635,-2.616; 4 1.905,-2.616; 5 1.905,2.616; 6 0.635,2.616; 7 -0.635,2.616; 8 -1.905,2.616
WE_POE = drill 0.9 square: 1 -5.715,8.89 | drill 0.9 round: 2 -4.445,6.35; 3 -3.175,8.89; 4 -1.905,6.35; 5 -0.635,8.89; 6 0.635,6.35; 7 1.905,8.89; 8 3.175,6.35; 9 4.445,8.89; 10 5.715,6.35 | drill 1 round: LED1+ -6.629,-4.064; LED1- -4.089,-4.064; LED2+ 6.629,-4.064; LED2- 4.089,-4.064 | drill 1.6 round: NC0 -7.747,3.048; NC1 7.747,3.048 | hole 3.25: -5.715,0; 5.715,0
MICRO-SD = smd 0.65 x 1.6: 1 -10.54,16.6; 2 -9.44,16.6; 3 -8.34,16.6; 4 -7.24,16.6; 5 -6.14,16.6; 6 -5.04,16.6; 7 -3.94,16.6; 8 -2.84,16.6 | smd 1.6 x 2.1: K1 -0.8,6.5 | smd 1.6 x 2.8: K2 -0.8,14.1
C0805 = smd 1.3 x 1.5: 1 -0.95,0; 2 0.95,0
MICRO3 = smd 0.9 x 1.1: 1 -0.95,-1; 2 0.95,-1; 3 0,1
SO8' = smd 0.66 x 2.032: 1 -1.905,-3.073; 2 -0.635,-3.073; 3 0.635,-3.073; 4 1.905,-3.073; 5 1.905,3.073; 6 0.635,3.073; 7 -0.635,3.073; 8 -1.905,3.073
SOT23-5 = smd 0.635 x 1.27: 1 -0.953,-1.27; 2 0,-1.27; 3 0.953,-1.27; 4 0.953,1.27; 5 -0.953,1.27
USB-A-S = smd 3 x 0.9: D+ 3.45,-1; D- 3.45,1; GND 3.45,-3; VBUS 3.45,3 | drill 2.311 round: P$5 0,-6.566; P$6 0,6.566
C1206 = smd 1.6 x 1.8: 1 -1.4,0; 2 1.4,0
L4532M = smd 2 x 2.4: 1 -1.9,0; 2 1.9,0
LQFP-48 = smd 0.25 x 1: 1 -2.75,-4.25; 2 -2.25,-4.25; 3 -1.75,-4.25; 4 -1.25,-4.25; 5 -0.75,-4.25; 6 -0.25,-4.25; 7 0.25,-4.25; 8 0.75,-4.25; 9 1.25,-4.25; 10 1.75,-4.25; 11 2.25,-4.25; 12 2.75,-4.25; 25 2.75,4.25; 26 2.25,4.25; 27 1.75,4.25; 28 1.25,4.25; 29 0.75,4.25; 30 0.25,4.25; 31 -0.25,4.25; 32 -0.75,4.25; 33 -1.25,4.25; 34 -1.75,4.25; 35 -2.25,4.25; 36 -2.75,4.25 | smd 1 x 0.25: 13 4.25,-2.75; 14 4.25,-2.25; 15 4.25,-1.75; 16 4.25,-1.25; 17 4.25,-0.75; 18 4.25,-0.25; 19 4.25,0.25; 20 4.25,0.75; 21 4.25,1.25; 22 4.25,1.75; 23 4.25,2.25; 24 4.25,2.75; 37 -4.25,2.75; 38 -4.25,2.25; 39 -4.25,1.75; 40 -4.25,1.25; 41 -4.25,0.75; 42 -4.25,0.25; 43 -4.25,-0.25; 44 -4.25,-0.75; 45 -4.25,-1.25; 46 -4.25,-1.75; 47 -4.25,-2.25; 48 -4.25,-2.75
C1812 = smd 1.9 x 3.4: 1 -1.95,0; 2 1.95,0
GND-GNDA = smd 1.27 x 1.27: GND -1.27,0; GNDA 1.27,0

### Placement (x,y rotation side)
ARM  44.45,38.1 270 top
ARM_C1  28.26,39.21 270 top
ARM_C2  28.26,34.45 90 top
ARM_C3  45.19,54.35 180 top
ARM_C4  41.12,54.29 0 top
ARM_C5  49.85,43.5 135 bottom
ARM_C6  49.85,32.7 225 bottom
ARM_C7  39.05,32.7 315 bottom
ARM_C8  39.05,43.5 45 bottom
ARM_C9  42.86,39.69 225 bottom
ARM_C10  42.86,36.51 135 bottom
ARM_C11  46.04,36.51 45 bottom
ARM_C12  46.04,39.69 315 bottom
ARM_Q1  31.43,36.83 90 top
ARM_Q2  43.02,51.12 180 top
ARM_R1  45.72,27.3 180 top
ARM_R2  55.24,36.83 270 top
ARM_R3  40.32,27.3 180 top
C1  24.13,9.53 90 top
C2  29.21,11.43 90 top
C3  36.83,11.43 270 top
C4  53.34,9.53 90 top
C5  37.94,22.7 180 top
C6  37.94,20.64 0 top
C7  33.66,22.7 0 top
C8  29.37,20 180 top
C9  29.37,22.07 180 top
C10  23.02,71.75 90 top
C11  26.51,70.17 180 top
C12  30,71.75 270 top
C13  28.42,47.15 180 top
C14  30,50.64 270 top
C15  28.42,54.13 0 top
D1  33.02,4.76 180 top
EXP  61.59,53.98 90 top
EXP_C1  62.23,30.48 0 top
EXP_C2  62.23,30.48 180 bottom
FM  50.64,21.91 270 top
FM_C1  50.64,17.78 0 top
FM_R1  45.88,21.27 270 top
FUSE  8.26,25.4 270 top
GND  3.81,23.5 90 top
JTAG  61.59,15.88 90 top
L1  43.18,9.21 90 top
L2  19.68,73.66 0 top
OUT  0.95,64.14 90 top
POE  17.14,25.4 180 top
POE+  3.81,31.11 90 top
POE_CLA  23.34,24.77 90 top
POE_D1  12.06,25.4 90 top
POE_DET  25.4,24.77 90 top
POE_ILM  21.27,24.77 90 top
PWR+  3.81,27.3 90 top
RJ  8.26,45.09 270 top
RJ_C1  21.59,45.88 0 top
RJ_C2  21.59,54.13 180 top
RJ_C3  24.29,53.02 270 top
RJ_C4  21.59,47.94 180 top
RJ_C5  21.59,43.81 180 top
RJ_C6  24.29,38.58 90 top
RJ_C7  21.59,37.62 180 top
RJ_R1  21.59,52.07 0 top
RJ_R2  21.59,50.01 0 top
RJ_R3  21.59,41.75 0 top
RJ_R4  21.59,39.69 0 top
RJ_R5  21.59,35.56 0 top
RJ_R6  21.59,33.5 0 top
SD  -0.64,36.2 90 bottom
SD_C1  19.68,28.89 180 bottom
SD_C2  18.26,19.05 180 bottom
SD_C3  18.26,15.56 180 bottom
SD_Q1  21.91,22.23 0 bottom
SD_R1  21.91,19.05 180 bottom
SD_R2  19.69,33.34 0 bottom
SD_R3  23.5,33.34 180 bottom
SD_R4  25.08,22.23 90 bottom
SD_R5  19.68,25.72 0 bottom
U1  MAX5035BUSA  [SO8']  33.02,11.43 180 top
U2  33.66,20.16 90 top
U3  26.51,72.71 270 top
U4  27.46,50.64 0 top
USB  7.62,11.43 0 top
USB_C1  14.92,5.56 180 top
USB_C2  15.08,15.87 0 top
USB_C3  15.08,13.81 0 top
USB_C4  18.41,11.43 270 top
USB_L1  18.41,5.4 90 top
USB_Q1  14.92,10.79 0 top
USB_R1  14.92,7.62 180 top
USB_R2  14.92,3.49 0 top
VS  38.1,65.88 0 top
VS_C1  51.44,62.07 270 top
VS_C2  51.44,69.69 90 top
VS_C3  23.97,57.94 0 top
VS_C4  23.97,66.2 0 top
VS_C5  23.97,62.07 0 top
VS_C6  30.16,63.34 0 top
VS_C7  38.1,58.58 270 top
VS_C8  41.12,73.18 90 top
VS_C9  44.45,61.91 270 top
VS_C10  36.2,58.58 270 top
VS_C11  37.15,73.18 90 top
VS_C12  44.45,70.01 90 top
VS_C13  30.16,69.06 180 top
VS_C14  30.16,65.25 180 top
VS_CL  19.68,60.01 90 top
VS_CL2  16.51,58.1 90 top
VS_CR  19.69,68.26 270 top
VS_CR2  16.51,70.17 90 top
VS_GBUF  23.97,64.13 180 top
VS_GND  3.81,57.63 0 top
VS_Q1  48.26,65.88 270 top
VS_R1  51.43,65.88 90 top
VS_R2  34.29,73.18 270 top
VS_R3  26.67,59.06 90 top
VS_R4  26.67,67.31 90 top
VS_R5  26.67,63.18 90 top
VS_R6  16.51,66.52 90 top
VS_R7  16.51,61.75 270 top
VS_RL  23.97,60.01 180 top
VS_RR  23.97,68.26 180 top
~NUDEV~1  31.43,57.94 180 top

### Tracks (layer width: path | path; a pad name or v marks a point on that pad's centre or on a via)
8  (via drill 0.3)
  Top 0.254: ARM.47 37.65,33.62 38.1,33.18 38.1,31.75 v36.83,30.48
  Bottom 0.254: EXP.8 59.05,41.27 58.42,40.64 58.42,31.75 50.96,24.29 43.02,24.29 v36.83,30.48
9  (via drill 0.3)
  Top 0.254: ARM.70 v47.95,26.04 v47.94,26.04
  Bottom 0.254: EXP.9 61.59,42.55 59.05,42.55 57.78,41.27 57.78,32.07 50.96,25.24 48.74,25.24 v47.94,26.04
10  (via drill 0.3)
  Top 0.254: v49.05,26.51 49.05,27.3 48.45,27.91 ARM.71
  Bottom 0.254: EXP.10 59.05,43.81 57.15,41.91 57.15,32.38 50.8,26.04 49.53,26.04 | v49.05,26.51 49.53,26.04 | 49.53,26.04
14
  Top 0.254: ARM.90 54.34,39.1 58.42,43.18 58.42,48.26 59.05,48.9 EXP.14
15
  Top 0.254: ARM.91 53.89,39.6 57.78,43.5 57.78,48.9 59.05,50.16 61.59,50.16 EXP.15
16
  Top 0.254: ARM.92 53.44,40.1 57.15,43.81 57.15,49.53 59.05,51.44 EXP.16
17
  Top 0.254: EXP.17 61.59,52.7 59.05,52.7 56.52,50.16 56.52,44.13 53.98,41.6 ARM.95
18
  Top 0.254: EXP.18 59.05,53.98 55.88,50.8 55.88,44.45 53.53,42.1 ARM.96
19
  Top 0.254: ARM.99 53.44,43.6 55.24,45.4 55.24,51.44 59.05,55.24 61.59,55.24 EXP.19
20
  Top 0.254: ARM.100 52.99,44.1 54.61,45.72 54.61,52.07 59.05,56.52 EXP.20
21
  Top 0.254: ARM.1 50.45,46.48 51.72,46.48 53.98,48.74 53.98,52.7 | 53.98,52.7 59.05,57.78 61.59,57.78 EXP.21 | 53.98,52.7
22
  Top 0.254: ARM.2 49.95,46.93 50.32,47.31 51.59,47.31 53.34,49.05 53.34,53.34 59.05,59.05 EXP.22
23
  Top 0.254: EXP.23 61.59,60.33 59.05,60.33 52.7,53.98 52.7,49.37 51.28,47.94 49.37,47.94 48.74,47.31 48.45,47.02 ARM.5
24
  Top 0.254: EXP.24 59.05,61.59 52.07,54.61 52.07,49.69 50.96,48.58 49.05,48.58 47.95,47.47 ARM.6
25
  Top 0.254: ARM.10 45.95,47.06 48.1,49.21 50.64,49.21 51.44,50.01 51.44,55.24 59.05,62.87 61.59,62.87 EXP.25
26  (via drill 0.3)
  Top 0.254: ARM.11 45.45,43.86 v45.4,43.81
  Bottom 0.254: v45.4,43.81 45.56,43.81 46.2,44.45 46.2,51.28 59.05,64.14 EXP.26
27  (via drill 0.3)
  Top 0.254: v45.24,47.78 45.24,47.31 44.95,47.01 ARM.12
  Bottom 0.254: v45.24,47.78 45.24,51.59 59.05,65.41 61.59,65.41 EXP.27
28  (via drill 0.3)
  Top 0.254: v43.97,47.78 43.97,47.47 44.45,46.99 ARM.13
  Bottom 0.254: v43.97,47.78 43.97,51.59 59.05,66.67 EXP.28
29  (via drill 0.3)
  Top 0.254: v42.55,43.81 41.95,44.41 ARM.18
  Bottom 0.254: v42.55,43.81 42.7,43.97 42.7,51.59 59.05,67.94 61.59,67.94 EXP.29
30  (via drill 0.3)
  Top 0.254: ARM.19 41.45,47.64 v41.59,47.78 | v41.59,47.78
  Bottom 0.254: v41.59,47.78 41.59,51.75 59.05,69.22 EXP.30
31  (via drill 0.3)
  Top 0.254: ARM.22 39.95,46.94 40.48,47.47 v40.48,47.78
  Bottom 0.254: v40.48,47.78 40.48,51.91 59.05,70.48 61.59,70.48 EXP.31
32  (via drill 0.3)
  Top 0.254: v39.37,47.78 | ARM.23 39.45,47.7 v39.37,47.78
  Bottom 0.254: v39.37,47.78 39.37,52.07 59.05,71.75 EXP.32
33  (via drill 0.3)
  Top 0.254: ARM.24 38.95,46.93 38.26,47.62 v38.26,47.78
  Bottom 0.254: v38.26,47.78 38.26,52.23 59.05,73.03 61.59,73.03 EXP.33
34  (via drill 0.3)
  Top 0.254: ARM.25 38.45,46.48 38.42,46.51 v37.78,46.51 | v37.78,46.51
  Bottom 0.254: v37.78,46.51 37.47,46.83 37.47,52.7 59.05,74.3 EXP.34
+1V8  (via drill 0.3)
  Top 0.254: VS.31 37.85,71.05 37.15,71.75 37.15,72.23 VS_C11.1 | VS.24 42.76,68.63 42.86,68.74 | 36.35,59.37 | 36.35,59.53 36.35,59.85 37.35,60.84 VS.5 37.35,62.91 37.62,63.18 | 36.35,59.53 36.35,59.37 | 37.62,63.18 | VS.7 38.35,62.93 38.1,63.18 37.62,63.18 | VS_C10.1 36.25,59.43 36.35,59.53 | v37.62,63.66 37.62,63.18 | v37.62,63.66
  Top 0.406: U4.5 v26.51,54.13 C15.1 | v36.04,72.23 37.15,72.23 | v42.86,69.53 42.86,68.74 44.03,68.74 VS_C12.1 44.45,69.22 | 44.45,69.22
  Bottom 0.406: v36.04,72.23 | v36.04,72.23 37.62,73.82 40.32,73.82 42.86,71.28 v42.86,69.53 | v37.62,63.66 36.04,65.25 v36.04,72.23 | v26.51,54.13 28.1,54.13 v37.62,63.66 | v37.62,63.66
+2V8  (via drill 0.3)
  Top 0.254: VS.38 32.99,68.13 v32.07,69.06 | VS_C14.1 v32.07,65.25 32.45,65.63 VS.43 34.7,65.63 34.92,65.41 34.92,64.93 34.63,64.63 VS.45
  Top 0.406: 30,73.66 29.84,73.66 | 29.84,73.66 U3.5 | 30,73.66 C12.1 | 29.84,73.66 | 30.96,69.06 VS_C13.1 v32.07,69.06 | v31.11,73.66 30,73.66 | v31.11,73.66
  Bottom 0.406: v32.07,69.06 | v32.07,69.06 31.11,70.01 v31.11,73.66 | v32.07,65.25 v32.07,69.06
+3V3  (via drill 0.3)
  Top 0.254: 41.12,72.23 VS_C8.1 41.12,72.39 | 37.35,68.85 VS.32 | 40.35,67.12 VS.26 40.35,70.99 41.12,71.75 41.12,72.39 | VS.6 37.85,60.89 38.1,60.64 VS_C7.1 | VS_C9.1 44.45,62.71 43.52,63.63 VS.14 40.67,63.63 v40.64,63.66 40.51,63.79 40.51,66.2 | 40.35,67.12 40.51,66.97 40.51,66.2 | 40.35,67.12 40.35,67.15 | 50.48,35.24 50.48,35.56 50.96,36.04 52.39,36.04 | ARM.81 50.81,34.6 50.48,34.92 50.48,35.24 | ARM.44 40.01,35.12 v40.01,35.24 | ARM.36 40.01,39.12 v40.01,39.37 | ARM.93 48.9,40.6 v48.9,40.64 | v48.9,35.24 50.48,35.24 | ARM.20 v40.95,42.55 v40.96,42.55 | v46.99,33.66 46.95,33.66 ARM.68 46.95,27.34 46.55,27.34 46.51,27.3 ARM_R1.1 | v40.96,33.66 v40.95,33.66 ARM.56 40.95,29.04 39.47,27.57 ARM_R3.2 | 49.45,43.1 ARM.3 | 49.45,43.1 ARM.98 | v48.9,42.55 49.45,43.1 | v46.67,42.55 46.67,43.34 46.95,43.62 ARM.8 | v39.21,59.53 38.42,59.53 38.31,59.43 VS_C7.1 | FM.8 53.34,23.18 53.38,23.13 | ARM_R2.2 55.24,36.04 52.39,36.04 | 40.64,66.13 40.71,66.13 | 40.64,66.13 VS.19 | RJ.3 17.78,48.26 20.16,45.88 20.8,45.88 | 20.8,45.88 | 20.8,45.88 RJ_C1.1 | 40.64,66.13 40.64,66.2 40.51,66.2 | ARM.32 37.63,41.12 37.78,41.27 v40.01,41.27 | 41.12,72.39 | 52.39,36.04 ARM.84 | ARM.83 52.33,35.97 52.39,36.04 | 37.35,68.85 | 37.35,68.85 39.05,67.15 40.32,67.15 40.35,67.12 | 50.01,17.94 49.95,17.94 FM_C1.1 | VS_C7.1 38.1,59.37
  Top 0.406: RJ.4 15.24,46.99 16.51,48.26 RJ.3 | 53.38,22.54 FM.7 | 53.38,22.54 53.38,23.13 | 50.01,17.94 50.01,20.64 | 50.01,20.64 48.1,20.64 | 48.1,20.64 FM.3 | v48.58,17.78 FM_C1.1 | v29.05,31.11 28.1,31.11 26.67,32.54 26.67,41.91 | 50.01,20.64 51.91,22.54 53.38,22.54 | 26.67,41.91 | 26.67,41.91 31.91,47.15 31.91,52.39 v35.24,55.72 | FM_R1.2 45.88,20.64 48.1,20.64 | C8.1 30.22,19.79 30.8,19.21 U2.5 | C8.1 30.22,19.74 | v30.16,17.46 30.16,19.95 C8.1 | C8.1 C9.1 | C9.1 | C9.1 30.22,24.34 v30.32,24.45
  Bottom 0.254: 40.32,33.97 ARM_C7.1 | 48.58,33.97 ARM_C6.1 | 40.32,42.23 ARM_C8.1 | v48.9,42.55 ARM_C5.1 | RJ.LED2+ 4.19,38.35 | 20.95,19.05 SD_R1.1 20.96,19.05 20.9,19.05
  Bottom 0.406: 40.01,34.61 v40.01,39.37 v40.01,41.27 40.01,41.91 40.32,42.23 40.64,42.55 v40.96,42.55 v46.67,42.55 v48.9,42.55 v48.9,40.64 v48.9,35.24 48.9,34.29 48.58,33.97 48.26,33.66 v46.99,33.66 v40.96,33.66 40.64,33.66 40.32,33.97 40.01,34.29 40.01,34.61 | 40.01,34.61 v40.01,35.24 | RJ.LED1+ 3.45,51.71 2.54,50.8 2.54,46.99 | 2.54,46.99 2.54,39.37 3.45,38.46 RJ.LED2+ 3.81,38.08 3.81,26.67 13.02,17.46 20.95,17.46 v30.16,17.46 48.58,17.46 | 2.54,46.99 RJ.4 | 64.45,30.48 64.45,6.03 JTAG.1 61.12,2.7 59.69,2.7 57.15,5.24 57.15,9.68 49.37,17.46 48.58,17.46 | 64.45,30.48 64.45,37.15 EXP.5 EXP.6 | 48.58,17.46 v48.58,17.78 | 40.01,34.61 | 40.01,34.61 38.1,34.61 33.66,30.16 33.66,27.78 v30.32,24.45 | 64.45,30.48 EXP_C2.2 | v30.32,24.45 29.05,25.72 v29.05,31.11 | v30.32,24.45 | v40.64,63.66 40.64,61.59 39.21,60.17 v39.21,59.53 39.05,59.53 v35.24,55.72
  Bottom 0.61: 20.96,19.05 SD_Q1.2 | 20.95,19.05 20.95,17.46 20.95,16.67 19.84,15.56 SD_C3.2 | 20.9,19.05 SD_C2.2
+5V  (via drill 0.3)
  Top 0.254: EXP.3 EXP.4 | U4.3 28.42,50.32 28.1,50.64 26.83,50.64 26.51,50.32 U4.1 | 34.61,19.21 33.97,19.21 33.66,19.53 33.66,20.8 33.97,21.11 U2.3 | C4.+ 53.34,12.86
  Top 0.406: 31.11,14.29 U1.4 31.11,13.81 | EXP.4 EXP.3 64.45,34.61 64.45,30.48 | 64.45,30.48 64.45,3.65 63.5,2.7 59.69,2.7 57.15,5.24 57.15,7.94 54.13,10.95 | 64.45,30.48 EXP_C1.2 | 34.61,19.21 | 38.89,22.7 v38.89,24.29 | v36.04,28.1 29.69,28.1 25.72,32.07 v25.72,47.15 26.51,47.15 | 26.51,47.15 C13.2 | 26.51,47.15 U4.1 | v51.44,10.79 51.91,10.79 52.86,11.75 53.34,11.75 | 53.34,11.75 C4.+ | 54.13,10.95 | 53.34,11.75 54.13,10.95 | 38.89,20.64 C6.2 | 38.89,22.7 C5.1 | 38.89,22.7 | U2.1 34.61,19.21 | v16.51,73.66 L2.1 | v20.64,2.86 19.05,2.86 USB_L1.1 | 38.89,19.21 | 38.89,16.83
  Top 0.61: U1.4 31.11,15.88 32.07,16.83 38.89,16.83 | 39.05,16.83 38.89,16.83 | 41.75,14.13 43.02,14.13 L1.2 | 38.89,19.21 38.89,20.64 38.89,22.7 | 38.89,19.21 U2.1 | 38.89,16.83 38.89,19.21
  Top 0.813: 41.75,14.13 39.05,16.83
  Top 2.184: L1.2 51.83,14.29 C4.+
  Bottom 0.406: v38.89,24.29 38.89,25.24 v36.04,28.1 | v25.72,47.15 16.51,56.36 v16.51,73.66 | v20.64,2.86 43.5,2.86 v51.44,10.79
AGND
  Top 0.254: VS.40 33.85,67.12 33.85,67.11 VS.41
  Top 0.406: U3.2 24.13,72.71 24.13,71.28
  pour Top (isolate 0.254): 0.48,71.76 32.86,71.75 36.2,68.42 36.2,63.02 29.37,56.2 0.48,56.2
BST
  Top 0.406: 34.92,14.61 U1.1
  Top 0.61: C3.1 36.83,12.7 34.92,14.61
CLASS
  Top 0.406: 17.78,27.94 POE.2 17.78,29.21 18.41,29.84 19.84,29.84 23.34,26.35 POE_CLA.2
DET
  Top 0.406: POE_DET.2 25.4,25.72 20.32,30.8 17.62,30.8 16.51,29.69 POE.3
FM_CS
  Top 0.254: ARM.73 49.45,28.81 50.16,28.1 50.48,28.1 | 50.48,28.1 51.12,27.46 51.12,25.56 48.74,23.18 47.94,23.18 | 50.48,28.1 | FM_R1.1 45.88,22.23 46.83,23.18 47.94,23.18 | 47.94,23.18 FM.1
GBUF
  Top 0.254: VS_GBUF.1 26.57,64.14 VS_R5.2 26.67,63.98 28.26,65.56 28.26,65.88 28.73,66.36 32.23,66.36 32.45,66.13 VS.42
GND  (via drill 0.3)
  Top 0.254: U2.2 35.24,20.16 | 35.24,20.16
  Top 0.813: ~NUDEV~1.GND 30.64,57.94
  other vias: 37.47,65.88 32.39,24.29 27.46,45.09 30.96,54.13 44.45,38.1 54.29,17.14 28.26,36.83 38.42,36.83 52.7,45.88 50.16,36.83 53.98,35.08 48.89,2.54 42.55,32.38 50.16,39.37 50.16,53.34 48.26,65.88 52.7,73.66 11.43,2.54 29.21,15.08 48.26,32.23 29.21,42.55 50.17,41.75 5.71,73.66 46.04,70.8 15.87,54.61 4.44,54.61 32.38,6.51 35.4,29.69 42.54,38.1 44.45,40.01 46.35,38.1 44.45,36.2 45.09,18.57 38.26,42.23 21.59,6.35 37.47,15.08 22.23,31.12 24.45,28.58 24.76,36.35 24.13,46.99 17.14,20.32 5.71,21.59 44.77,32.38 33.34,31.75 4.29,45.09 40.01,31.91 40.16,24.29 8.89,35.56 17.94,35.56 24.13,41.27 11.43,6.35 52.07,2.54 46.99,25.4 27.94,5.08 12.06,73.66 11.43,16.51 36.2,24.29 43.81,75.56 25.56,55.09 1.9,21.59 24.13,16.03
  pour Top (isolate 0.254, rank 2): 0.5,78.5 65.5,78.5 65.5,0.5 0.5,0.5
  pour Bottom (isolate 0.254): 0.5,78.5 65.5,78.5 65.5,0.5 0.5,0.5
GPIO  (via drill 0.3)
  Top 0.254: 35.35,69.9 35.35,69.27 35.88,68.74 36.2,68.74 | 36.61,70.13 36.83,70.13 36.83,70.14 36.83,70.13 VS.33 36.61,70.13 | 36.61,70.13 VS.34 | 36.61,70.13 36.61,70.14 36.61,69.15 36.2,68.74 | VS.10 | VS.10 VS.9 | VS.10 39.87,61.63 39.88,61.63 | VS.11 39.88,61.63 | VS.11 VS.12 40.84,61.63 40.8,61.59 | VS.11 | VS.10 | 35.35,69.9 VS.36 | 39.88,61.63 VS.10 | 39.37,61.59 39.35,61.62 VS.9 | 34.29,70.96 34.45,70.8 35.35,69.9 | 36.2,68.74 39.37,65.56 39.37,61.75 39.35,61.73 VS.9 | 34.29,70.96 | 34.29,70.96 VS_R2.2 34.29,72.39 | 34.29,70.96 | VS.25 41.08,70.13 v43.5,72.55 | 34.29,72.39 | v33.02,72.23 34.13,72.23 34.29,72.39
  Bottom 0.254: v33.02,72.23 35.88,75.09 40.96,75.09 v43.5,72.55
ILM
  Top 0.406: POE.1 19.05,27.94 19.21,27.94 21.38,25.77 21.38,25.61 POE_ILM.2
LED1
  Top 0.254: ARM.59 42.45,26.73 41.75,26.04 38.42,26.04 37.78,26.67 29.37,26.67 23.65,32.38 23.65,34.45 22.54,35.56 RJ_R5.2
LED2
  Top 0.254: ARM.60 42.95,26.44 41.91,25.4 38.1,25.4 37.47,26.04 29.05,26.04 22.86,32.23 22.86,33.34 22.54,33.66 22.44,33.55 RJ_R6.2 22.44,33.44
LEFT
  Top 0.254: VS.46 33.02,64.13 32.38,63.5 32.38,62.55 29.84,60.01 26.67,60.01 VS_R3.2 26.57,60.01 VS_RL.1
MDIO
  Top 0.254: ARM.58 41.95,28.93 41.43,28.42 41.43,27.62 41.12,27.3 ARM_R3.1
N$1
  Top 0.254: U3.3 26.19,71.75 26.51,72.07 26.51,73.34 26.19,73.66 U3.1
  Top 0.406: L2.2 23.02,73.66 | 23.02,73.66 C10.2 | 23.02,73.66 U3.1
N$2
  Top 0.254: USB_Q1.2 15.77,9.7 | 15.77,8.63 15.88,8.73 | USB_C4.2
  Top 0.61: 15.77,9.7 USB_R1.1 15.77,8.63 | 18.41,8.73 USB_L1.2 | 18.41,8.73 USB_C4.2 | 15.88,8.73 18.41,8.73
N$3
  Bottom 0.406: SD.1 18.77,25.66 SD_R5.2
N$4
  Top 0.254: RJ.LED2- 4.19,41.02 6.35,43.18 15.24,43.18 16.51,44.45 17.78,44.45 18.73,43.5 18.73,36.35 19.53,35.56 19.53,34.61 20.64,33.5 RJ_R6.1 20.8,33.5
N$5
  Top 0.254: RJ.LED1- 4.19,49.15 7.62,45.72 15.24,45.72 16.51,46.99 17.78,46.99 19.37,45.4 19.37,36.83 20.64,35.56 RJ_R5.1
N$6
  Top 0.254: RJ_R3.2 22.44,41.65 22.38,41.59 22.44,41.54 RJ_R4.2 24.29,39.69 RJ_C6.2
N$7
  Top 0.254: RJ_C3.2 24.29,52.07 RJ_R1.2 22.44,50.06 22.38,50.01 RJ_R2.2
N$8
  Top 0.254: 48.26,69.22 VS_Q1.1 | 48.26,69.22 48.26,68.84 | VS.18 44.68,65.63 48.26,69.22
  Top 0.406: 48.26,68.84 VS_C2.1 | VS_C2.1 VS_R1.2 | VS_C2.1
N$9
  Top 0.254: ARM.48 34.66,33.12 33.34,34.45 33.34,38.16 31.43,40.06
  Top 0.406: ARM_C1.1 31.43,40.06 ARM_Q1.2
N$10
  Top 0.254: 31.43,31.91 ARM_Q1.1 31.43,34.45 32.38,34.45 34.21,32.62 ARM.49
  Top 0.406: ARM_C2.1 31.43,33.6 ARM_Q1.1
N$11
  Top 0.254: 48.26,62.55 VS_Q1.2 | 48.26,62.55 48.26,62.92 | VS.17 45.68,65.13 48.26,62.55
  Top 0.406: 48.26,62.92 VS_C1.1 VS_R1.1 | VS_R1.1
N$12
  Top 0.254: 14.29,13.76 USB_C3.1 | USB.VBUS 11.26,14.43 11.27,14.45 | USB_C2.1
  Top 0.61: USB_Q1.3 14.92,12.38 14.29,13.02 14.29,13.76 | USB_C3.1 14.23,14.45 | 14.23,14.45 USB_C2.1 | 14.23,14.45 11.27,14.45
N$13
  Top 0.254: ARM.17 42.45,48.35 39.69,51.12 ARM_Q2.2
  Top 0.406: ARM_C4.1 40.27,51.12 ARM_Q2.2
N$14
  Top 0.254: ARM.16 42.95,48.03 46.04,51.12 ARM_Q2.1
  Top 0.406: ARM_C3.1 46.04,51.12 ARM_Q2.1
N$15
  Bottom 0.254: SD_R2.2 18.77,33.34 18.75,33.35
  Bottom 0.406: SD.8 18.75,33.35
N$16
  Top 0.254: USB_R2.1 USB_C1.2 | USB_C1.2 | USB_C1.2 USB_R1.2 14.07,9.7 USB_Q1.1
N$18
  Top 0.406: OUT.1 VS_GBUF.2 | OUT.1
  Top 0.61: VS_GND.1 2.96,64.04 OUT.1
N$19
  Top 0.406: OUT.3 11.62,69.19 15.08,65.72 16.45,65.72 VS_R6.1 16.51,65.72 | 16.51,65.72 | 16.51,65.72 19.09,65.72 VS_CR.2
N$20
  Top 0.254: 16.41,62.55 16.45,62.55 VS_R7.1 16.51,62.55
  Top 0.406: OUT.2 9.42,59.59 12.38,62.55 16.41,62.55 | 16.51,62.55 19.09,62.55 VS_CL.2
N$21
  Top 0.254: VS_CR.1 19.73,70.17 | VS_CR2.1 16.51,69.53
  Top 0.406: VS_RR.2 22.7,68.26 20.8,70.17 19.73,70.17 | 16.51,69.53 19,69.53 VS_CR.1
N$22
  Top 0.254: VS_CL.1 19.73,58.1 | VS_CL2.1 16.51,57.47
  Top 0.406: VS_RL.2 22.7,60.01 20.8,58.1 19.73,58.1 | 16.51,57.47 19.09,57.47 VS_CL.1
N$25
  Top 0.406: C7.1 32.38,22.7 U2.4
N$27
  Top 0.254: U3.4 | 27.46,71.75 U3.4 | U3.4 | 27.3,70.17 | C11.1 27.3,70.17 | 27.3,70.17 27.46,70.17
  Top 0.406: 27.46,70.17 27.46,71.75
N$28
  Top 0.406: C14.1 30,51.75 28.42,51.75 U4.4
N$31
  Top 0.254: VS_C3.2 26.41,57.94 VS_R3.1
N$32
  Top 0.254: VS_C4.2 26.41,66.2 VS_R4.1
N$33
  Top 0.254: VS_C5.2 26.41,62.07 VS_R5.1
OUT
  Top 0.61: 34.92,8.26 U1.8 | C3.2 36.83,10.16 34.92,8.26 | 34.92,8.26 35.72,8.26 35.72,7.62
  Top 1.422: D1.C 35.57,5.88 35.72,6.03
  Top 2.184: L1.1 37.62,4.13 35.72,6.03 35.72,7.62
POE+
  Top 0.61: RJ.9 17.14,39.37 8.89,31.11 POE+.1
POE-  (via drill 0.3)
  Top 0.254: 15.24,27.94 POE.4 | POE_D1.A
  Top 0.406: 15.24,27.94 15.24,26.67 15.88,26.04 18.73,26.04 20.85,23.91 | 20.85,23.91 | 20.85,23.91 POE_ILM.1 POE_CLA.1
  Top 0.61: 15.24,27.94 POE_D1.A 12.06,32.23 17.3,37.47 | 17.3,37.47 v17.3,37.62 | 17.3,37.47
  Bottom 0.61: RJ.10 15.56,39.37 v17.3,37.62
PWR+
  Top 0.406: 12.86,23.18 14.61,24.92 18.26,24.92 19.05,24.13 | 19.05,24.13 POE.8 | 19.05,24.13 19.05,22.23 24.13,22.23 25.4,23.5 POE_DET.1
  Top 0.61: 33.02,10.64 | 33.02,10.64 33.66,10 U1.7 | 31.75,10.64 33.02,10.64 | 31.75,10.64 31.11,10 31.11,8.41 | 31.75,10.64 | 12.86,23.18 | POE_D1.C 12.53,22.85 12.86,23.18 | 31.11,8.41 U1.5 | 30.8,8.26 30.96,8.26 31.11,8.41
  Top 0.813: C1.+ 24.13,11.75 17.46,18.41 15.24,18.41 12.06,21.59 POE_D1.C 12.06,23.34 8.92,23.34 FUSE.2
  Top 1.27: 24.13,11.75 27.62,8.26 30.8,8.26
RCAP
  Top 0.254: VS.44 33.06,65.13 31.33,63.4 31.01,63.4 30.96,63.34 VS_C6.2
RD+  (via drill 0.3)
  Top 0.254: ARM.40 34.9,37.12 v34.61,36.83 | RJ.1 18.41,52.07 20.64,52.07 | 20.64,52.07 RJ_R1.1 | RJ_C2.2 20.74,52.17 20.64,52.07
  Bottom 0.254: v34.61,36.83 30.32,36.83 19.05,48.1 19.05,49.21 | 19.05,49.21 | RJ.1 17.46,50.8 19.05,49.21
RD-  (via drill 0.3)
  Top 0.254: RJ_C4.2 20.64,47.94 v20.64,48.97 20.64,49.53 | 20.64,49.53 20.74,49.63 RJ_R2.1 | RJ.2 20.64,49.53 | ARM.37 35.29,38.62 v34.61,37.94
  Bottom 0.254: v20.64,48.97 20.64,48.9 31.59,37.94 | 31.59,37.94 v34.61,37.94 | 31.59,37.94
RESET
  Top 0.254: ARM_R1.2 44.93,27.3 44.95,27.28 ARM.64
RIGHT
  Top 0.254: VS_RR.1 26.57,68.26 VS_R4.2 26.89,67.94 32.38,67.94 32.7,67.63 VS.39
SCK  (via drill 0.3)
  Top 0.254: ARM.72 48.95,28.36 50.16,27.15 v50.16,26.99 | v51.91,20.64 FM.6 | v50.16,26.99 | v44.45,22.07 | v50.16,26.99 50.16,25.88 48.74,24.45 46.2,24.45 44.45,22.7 v44.45,22.07 | v44.45,22.07
  Bottom 0.254: EXP.11 61.59,45.09 59.05,45.09 56.52,42.55 56.52,32.7 50.8,26.99 v50.16,26.99 | 44.45,22.23 29.21,22.23 26.51,24.92 26.51,28.1 24.55,30.05 SD.5 | v51.91,20.64 46.35,20.64 44.77,22.23 44.45,22.23 | v51.91,20.64 | v51.91,20.64 | v44.45,22.07 | 44.45,22.23 v44.45,22.07
SD_3V3
  Bottom 0.254: SD_C1.1 18.73,28.89 | 14.03,28.95 13.97,28.89 13.97,33.34 15.24,34.29 17.46,34.29 17.78,34.61 19.68,34.61 20.54,33.76 SD_R2.1 | 20.48,25.72 21.91,24.29 SD_Q1.3 22.81,23.23 24.61,21.43 25.03,21.43 SD_R4.1 | 20.48,25.72 20.32,25.72 | 20.48,25.72 SD_R5.1 | SD_R2.1 SD_R3.1 | SD_R2.1
  Bottom 0.406: 13.97,28.89 13.97,22.54 14.92,21.59 17.14,21.59 18.78,23.23 SD_Q1.3 | 14.03,28.95 SD.4 18.77,28.95 SD_C1.1
SD_CS  (via drill 0.3)
  Top 0.254: ARM.67 46.45,31.97 v46.04,32.38 | v44.61,25.72 42.55,23.65 v42.55,20.64
  Bottom 0.254: SD.2 22.14,26.75 | v44.61,25.72 | v46.04,32.38 46.04,32.23 44.61,30.8 v44.61,25.72 | v42.55,20.64 28.26,20.64 25.08,23.81 | 22.14,26.75 | 22.14,26.75 25.08,23.81 | 25.08,23.81 SD_R4.2
SD_PWR  (via drill 0.3)
  Top 0.254: v45.88,25.72 45.88,25.56 43.5,23.18 v43.5,18.89 | v45.88,28.73 | ARM.66 45.95,28.8 v45.88,28.73
  Bottom 0.254: v45.88,25.72 v45.88,28.73 | v43.5,18.89 22.86,18.89 22.86,18.95 SD_R1.2 22.86,19.15 SD_Q1.1 | v43.5,18.89 | v43.5,18.89
SI  (via drill 0.3)
  Top 0.254: v54.93,19.37 FM.5 | v54.93,19.37 | ARM.75 50.45,30.04 50.48,30 v51.28,30 52.7,28.57 52.7,26.04 55.09,23.65 55.09,19.53 v54.93,19.37 | v54.93,19.37
  Bottom 0.254: SD.3 22.31,27.86 28.73,21.43 43.81,21.43 45.88,19.37 v54.93,19.37 | EXP.13 61.59,47.62 59.05,47.62 55.24,43.81 55.24,33.34 51.91,30 v51.28,30
SO  (via drill 0.3)
  Top 0.254: ARM.74 49.95,29.27 50.48,28.73 v51.28,28.73 | v49.37,21.91 FM.2 | v51.28,28.73 | v51.28,28.73 51.91,28.1 51.91,24.45 v49.37,21.91 | v49.37,21.91
  Bottom 0.254: SD.7 24.26,32.26 | EXP.12 59.05,46.35 55.88,43.18 | v49.37,21.91 48.26,23.02 29.69,23.02 27.62,25.08 27.62,28.89 24.26,32.26 | v51.28,28.73 51.59,28.73 55.88,33.02 55.88,43.18 | 55.88,43.18 | SD_R3.2 24.26,33.34 24.26,32.26
TCK
  Top 0.254: ARM.80 54.8,34.1 58.42,30.48 58.42,16.51 59.05,15.88 61.59,15.88 JTAG.9
TD+  (via drill 0.3)
  Top 0.254: RJ_C5.2 20.74,43.87 20.64,43.97 v20.64,42.78 20.64,41.75 RJ_R3.1 | ARM.43 34.7,35.62 v34.61,35.72
  Bottom 0.254: RJ.5 18.1,45.72 20.64,43.18 20.64,42.86 | v34.61,35.72 27.15,35.72 20.64,42.23 20.64,42.86 | v20.64,42.78 20.64,42.86
TD-  (via drill 0.3)
  Top 0.254: ARM.46 35.09,34.12 v34.61,34.61 | RJ_R4.1 20.64,39.69 v20.64,38.66 20.64,37.47 | 20.64,37.47 20.74,37.57 RJ_C7.2 | 20.64,37.47
  Bottom 0.254: RJ.6 17.78,44.45 19.37,42.86 19.37,40.48 21.11,38.73 | v34.61,34.61 25.24,34.61 21.11,38.73 | 20.8,38.73 | 21.11,38.73 20.8,38.73 | 20.8,38.73 20.72,38.73 v20.64,38.66
TDI
  Top 0.254: JTAG.5 61.59,10.79 59.05,10.79 57.15,12.7 57.15,29.84 53.9,33.1 ARM.78
TDO  (via drill 0.3)
  Top 0.254: ARM.77 53.44,32.6 54.77,31.27 v54.77,26.04 | v54.77,26.04
  Bottom 0.254: JTAG.13 61.59,20.95 59.05,20.95 54.77,25.24 v54.77,26.04 | v54.77,26.04
TMS
  Top 0.254: ARM.79 54.35,33.6 57.78,30.16 57.78,14.61 59.05,13.34 61.59,13.34 JTAG.7
TRST  (via drill 0.3)
  Top 0.254: JTAG.3 61.59,8.26 59.05,8.26 56.52,10.79 56.52,26.35 v56.04,26.83 | ARM.89 54.27,38.6 55.24,37.62 ARM_R2.1 55.51,37.68 56.99,36.2 56.99,34.13 v59.69,31.43 | v59.69,31.43
  Bottom 0.254: v59.69,31.43 59.69,30.48 v56.04,26.83
USB_PWR  (via drill 0.3)
  Top 0.254: ARM.61 43.45,26.15 41.12,23.81 v41.12,19.84 | v15.88,2.54 15.88,3.39 USB_R2.2 | v26.51,16.03 v26.51,19.84
  Bottom 0.254: v26.51,19.84 v41.12,19.84 | v26.51,16.03 15.88,5.4 v15.88,2.54
VCC
  Top 0.813: PWR+.1 3.81,27.15 8.26,27.15 FUSE.1
VCCIO  (via drill 0.3)
  Top 0.254: ARM.7 47.45,41.27 v47.31,41.27 | ARM.14 43.95,41.27 v44.13,41.27 | ARM.62 43.95,34.92 v43.81,34.92 | ARM.38 41.27,38.12 v41.27,38.1 | v47.62,38.1 ARM.88
  Bottom 0.254: 41.59,40.96 ARM_C9.1 | 41.59,35.24 ARM_C10.1 | 47.31,35.24 ARM_C11.1 | v47.31,41.27 47.47,41.12 ARM_C12.1
  Bottom 0.406: 41.59,35.24 41.27,35.56 v41.27,38.1 41.27,40.64 41.59,40.96 41.91,41.27 v44.13,41.27 v47.31,41.27 47.62,40.96 v47.62,38.1 47.62,35.56 47.31,35.24 46.99,34.92 v43.81,34.92 41.91,34.92 41.59,35.24
VD
  Top 0.406: U1.2 33.66,13.02 32.7,12.06 31.11,12.06 29.63,10.58 C2.1
VS_CS  (via drill 0.3)
  Top 0.254: ARM.34 38.3,40.12 v38.42,40.01 | v44.29,67.63 | VS.23 43.79,68.13 v44.29,67.63
  Bottom 0.254: v38.42,40.01 36.83,41.59 36.83,53.34 44.29,60.8 v44.29,67.63 | v44.29,67.63 | v44.29,67.63
VS_DCS
  Top 0.254: VS.13 42.44,63.13 42.55,63.02 42.55,59.37 38.73,55.56 37.15,55.56 33.34,51.75 33.34,43.97 34.69,42.62 ARM.29
VS_DREQ  (via drill 0.3)
  Top 0.254: VS.8 38.85,60.84 39.21,60.48 40.01,60.48 v40.64,59.85 | ARM.27 35.59,43.62 35.24,43.97 v35.24,46.35
  Bottom 0.254: 40.64,59.53 v40.64,59.85 | 40.64,59.53 | 40.64,59.53 35.24,54.13 v35.24,46.35
VS_RST  (via drill 0.3)
  Top 0.254: VS.3 36.35,60.96 35.88,60.48 35.24,60.48 34.77,60.01 34.77,57.47 v32.38,55.09 | ARM.35 34.86,39.62 v34.61,39.37
  Bottom 0.254: v32.38,55.09 32.38,41.59 v34.61,39.37 | v34.61,39.37
VS_SCK  (via drill 0.3)
  Top 0.254: VS.28 39.35,68.12 v39.37,68.1 | ARM.28 35.14,43.12 34.29,43.97 v34.29,45.09
  Bottom 0.254: v39.37,68.1 | v34.29,45.09 34.29,56.67 39.69,62.07 39.69,67.79 v39.37,68.1
VS_SI  (via drill 0.3)
  Top 0.254: v39.69,71.91 38.85,71.08 VS.29 | ARM.31 35.59,41.62 v34.61,40.64
  Bottom 0.254: v39.69,71.91 39.69,69.85 41.91,67.63 41.91,59.69 36.2,53.98 36.2,42.23 v34.61,40.64
VS_SO  (via drill 0.3)
  Top 0.254: v38.58,72.23 | VS.30 38.35,72 v38.58,72.23 | ARM.30 34.82,42.12 v34.61,41.91
  Bottom 0.254: v34.61,41.91 | v34.61,41.91 33.34,43.18 33.34,57.15 38.89,62.71 38.89,66.83 38.26,67.47 38.26,71.91 v38.58,72.23

### Text on the board
Top: WebRadio v2 - www.watterott.net | TOP | 34 | 2V8 | * | 1V8 | * | POE+ | 20 | VCC | * | GND | * | *
Bottom: WebRadio v2 - www.watterott.net | BOT | 34 | 20
tValues: Line-Out config. | See schematics for